# EasyEDA Pro project ProProject_Strain Gauge Paddle_2024-04-27.epro

# Schematic Strain Gauge Paddle

## Sheets
1 ESP and Power: Create Date: 2023-10-29; Page Name: ESP and Power; Project Name: Strain Gauge Paddle; Schematic Name: Strain Gauge Paddle; Update Date: 2024-03-07; Company: EasyEDA.com; Drawed: EasyEDA Pro; Page Size: A4; Part Number: JLCPCB-002; Reviewed: EasyEDA Pro; Version: V0.1
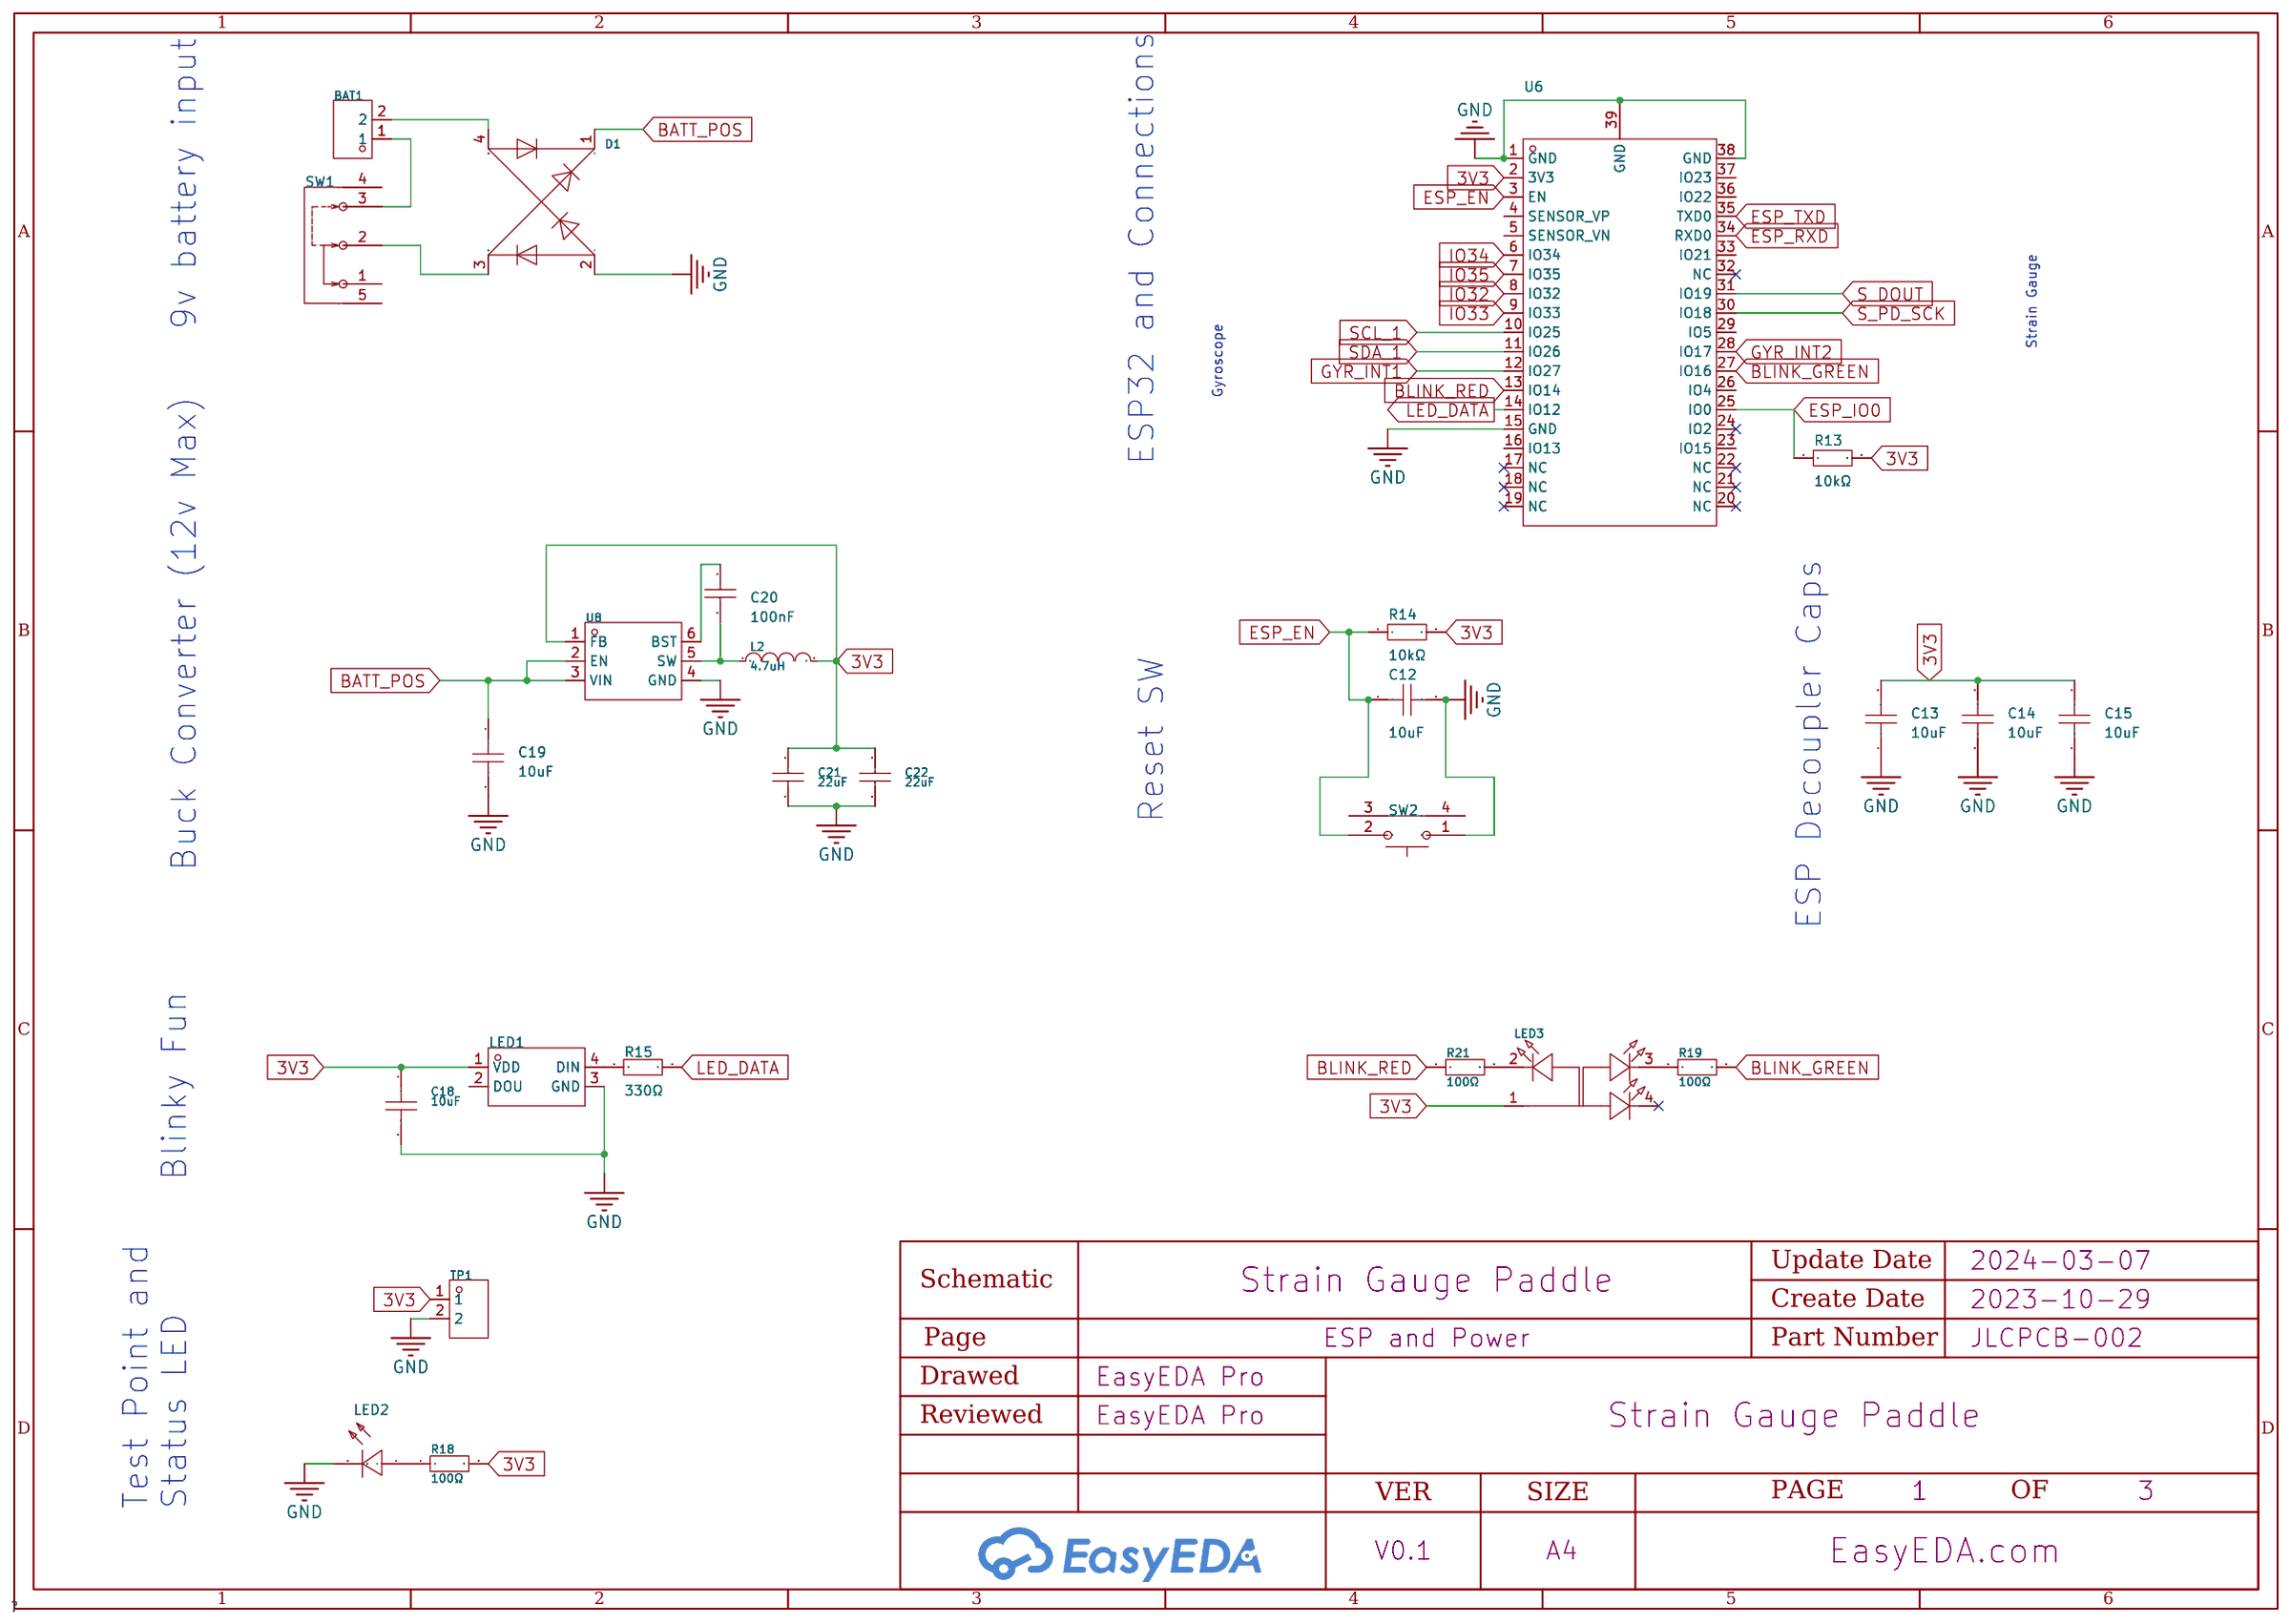
[diagram p0: ESP and Power]
2 Gyroscope and Strain Guage: Page Name: Gyroscope and Strain Guage; Update Date: 2024-03-12; Version: V0.2
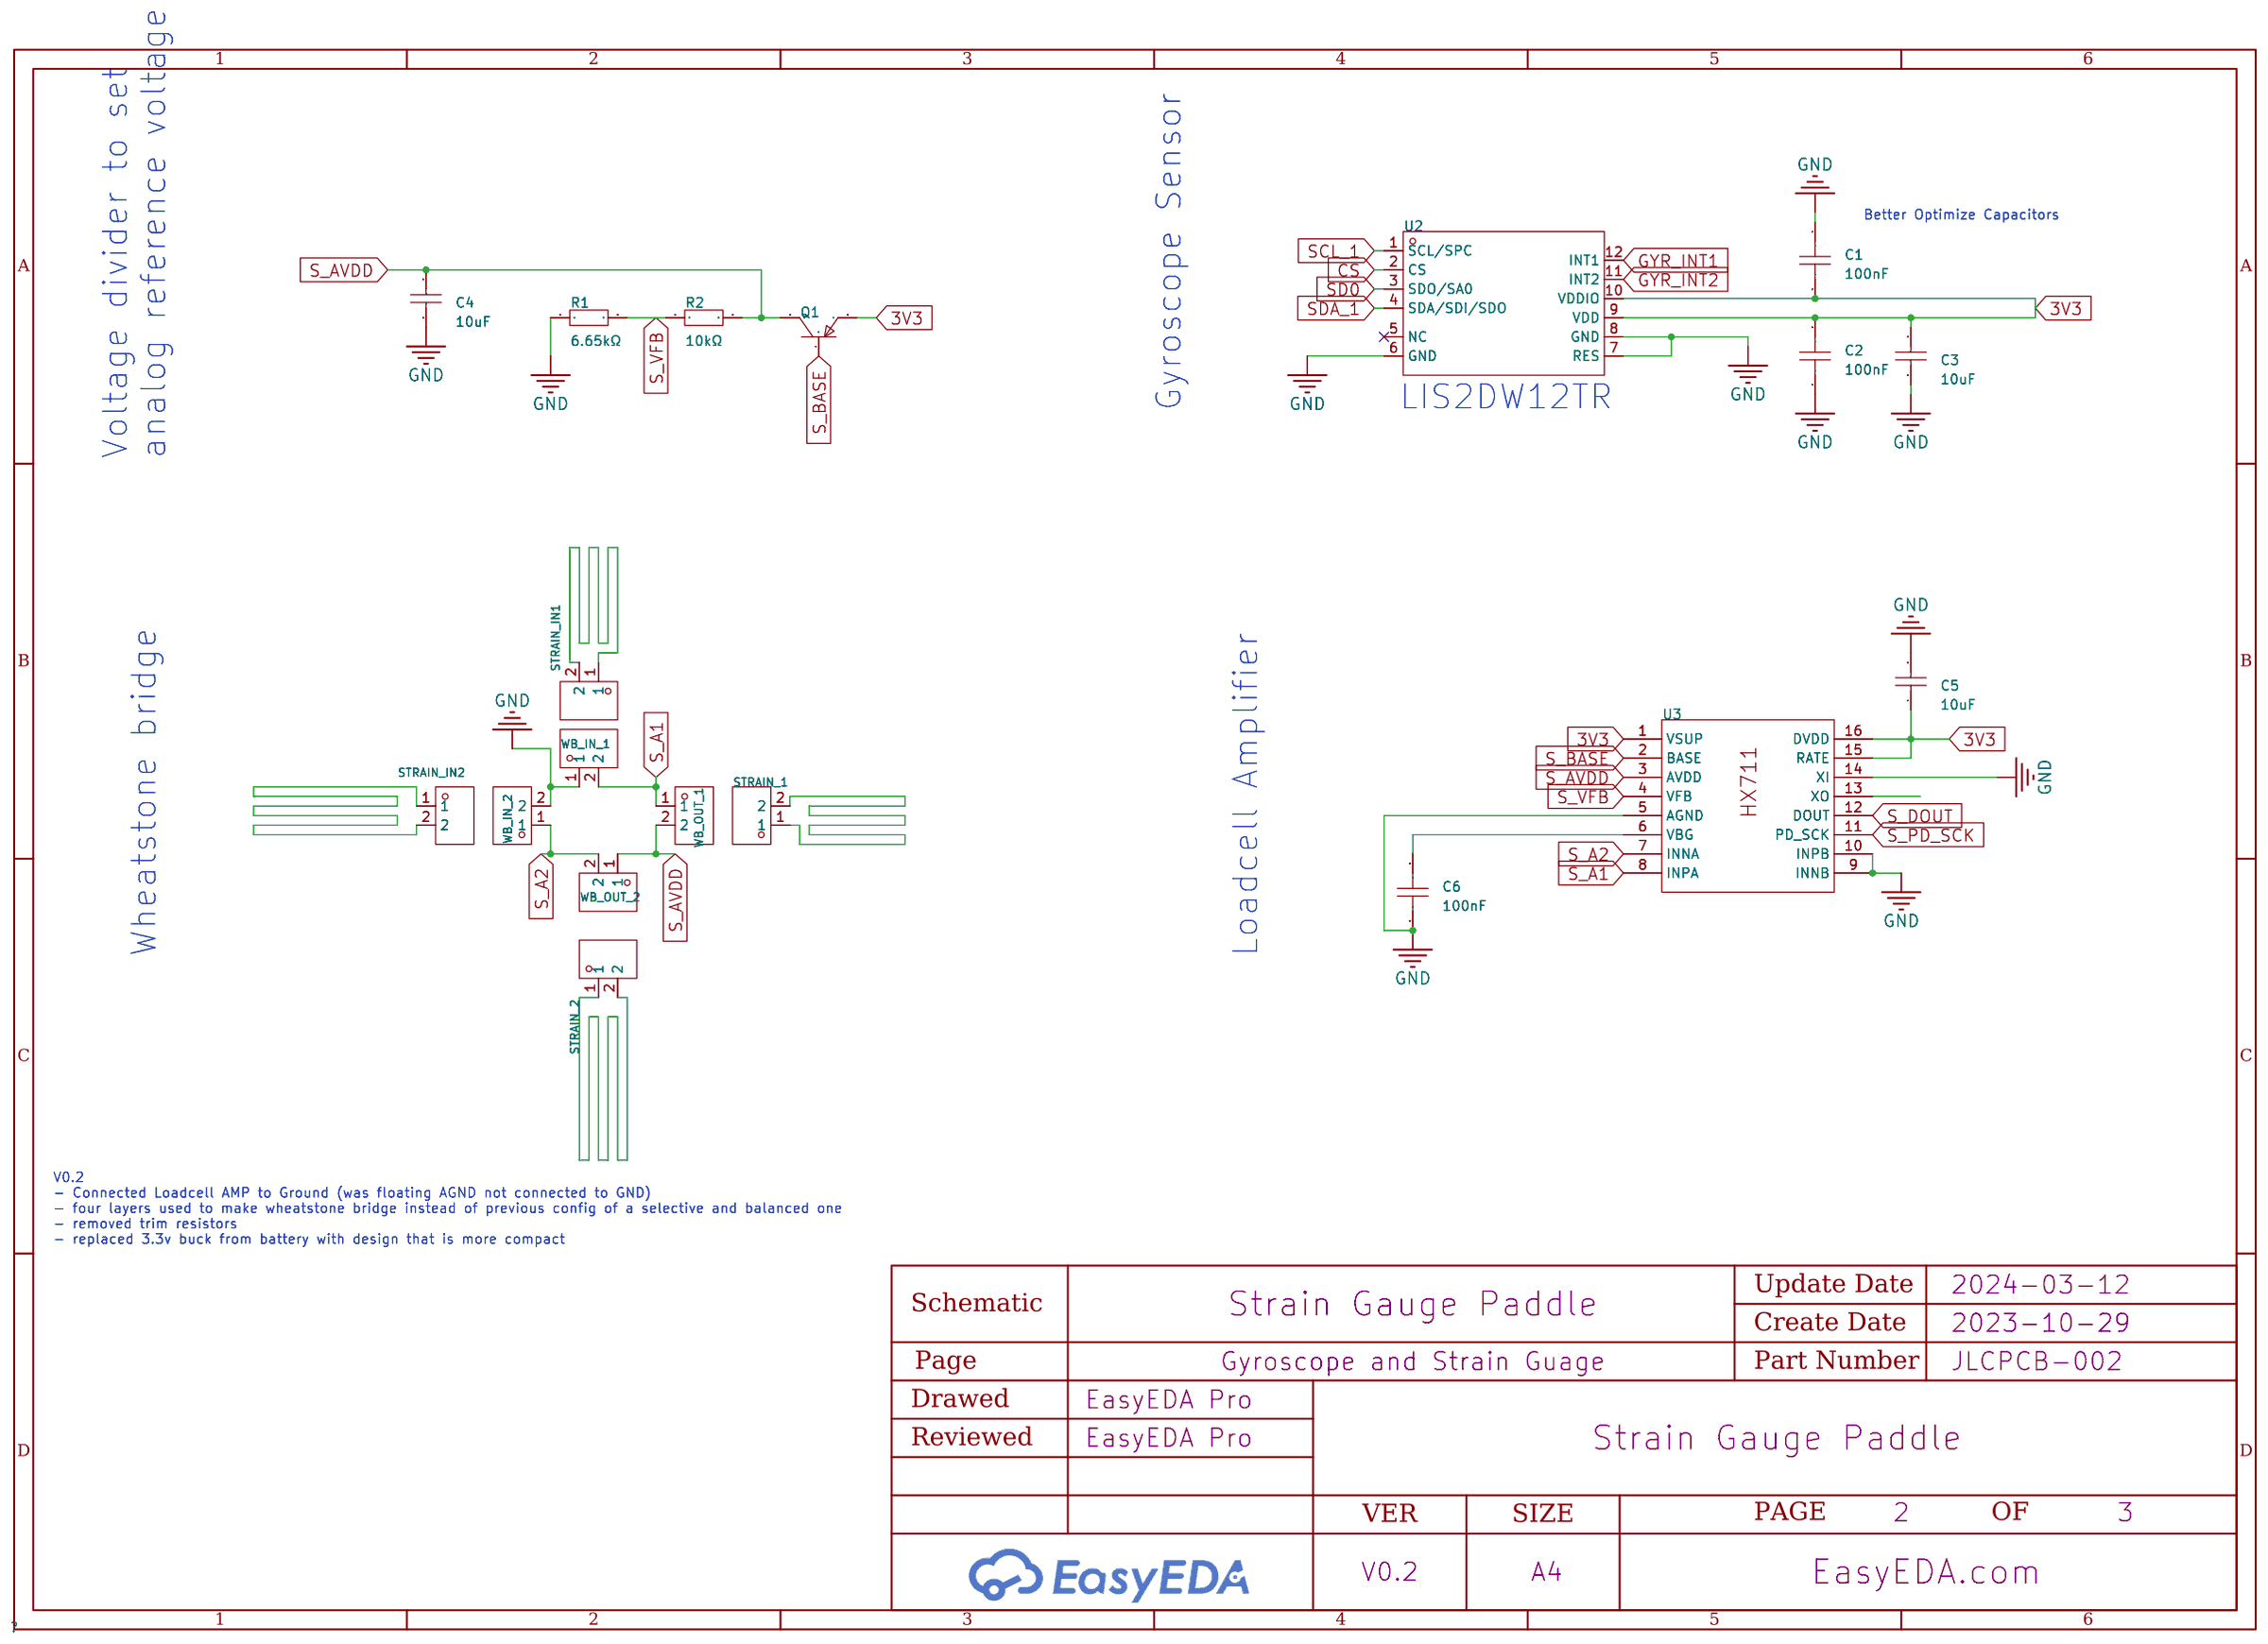
[diagram p1: Gyroscope and Strain Guage]
3 Serial: Create Date: 2023-11-12; Page Name: P3; Update Date: 2023-11-11
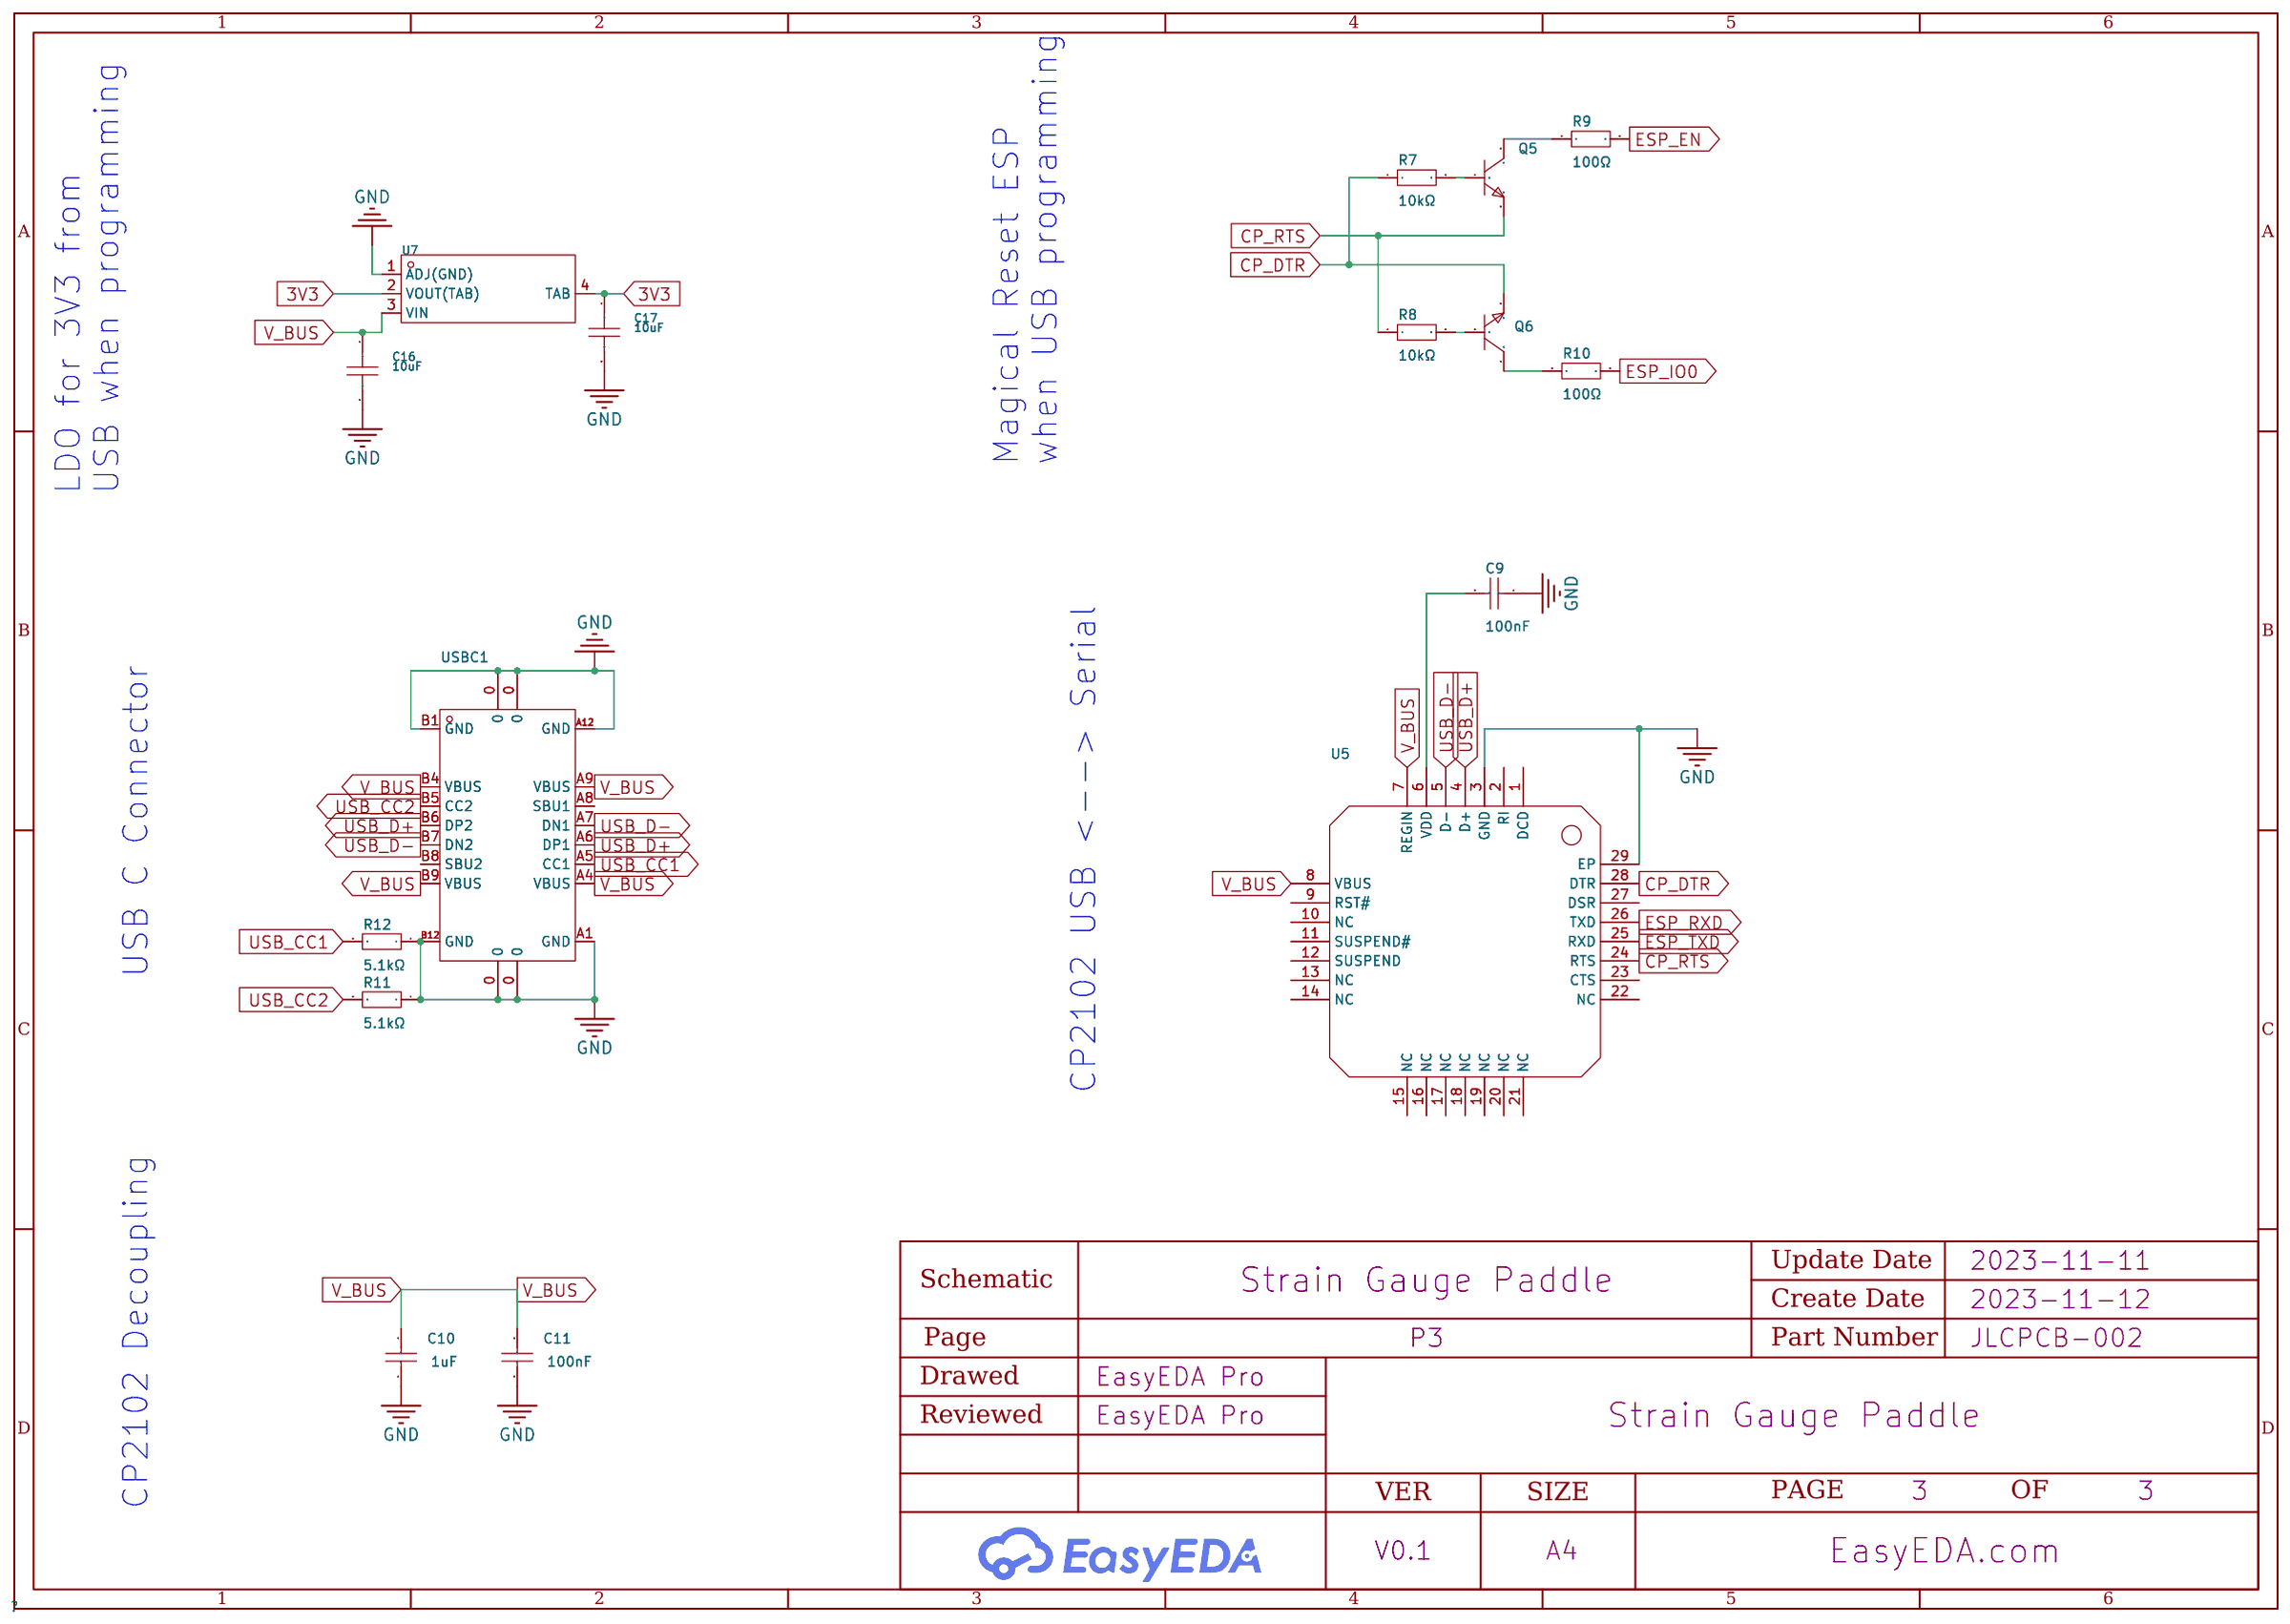
[diagram p2: Serial]

## Parts
sheet ESP and Power
BAT1  PZ254V-11-02P  [HDR-TH_2P-P2.54-V-M]  (no BOM)
C12  10uF  [C0402]
C13  10uF  [C0402]
C14  10uF  [C0402]
C15  10uF  [C0402]
C18  10uF  [C0603]
C19  10uF  [C0603]
C20  100nF  [C0603]
C21  22uF  [C1206]
C22  22uF  [C1206]
D1  MB10S  [MBS_L4.7-W3.8-P2.40-LS7.0-TL]
L2  4.7uH  [IND-SMD_L5.4-W5.2_FXL0530]
LED1  XL-5050RGBC-WS2812B  [LED-SMD_4P-L5.0-W5.0-BL_XL-5050RGBC]
LED2  BL-HJC36G-AV-TRB  [LED0603-R-RD_AMBER]
LED3  NH-B1010RGBT-HF  [LED-ARRAY-SMD_4P-L1.0-W1.0-TR_NH-B1010RGBT]
R13  10kΩ  [R0402]
R14  10kΩ  [R0402]
R15  330Ω  [R0603]
R18  100Ω  [R0603]
R19  100Ω  [R0603]
R21  100Ω  [R0603]
SW1  SK12D07VG4  [SW-TH_SK12D07VG4]
SW2  1TS003B-1400-3500A-CT  [KEY-SMD_1TS003B]
TP1  PZ254V-11-02P  [HDR-TH_2P-P2.54-V-M]  (no BOM)
U6  -  [WIFI-SMD_ESP32-WROOM-32E]
U8  AP63203WU-7  [TSOT-26_L2.9-W1.6-P0.95-LS2.8-BL]
sheet Gyroscope and Strain Guage
C1  100nF  [C0603]
C2  100nF  [C0603]
C3  10uF  [C0805]
C4  10uF  [C0805]
C5  10uF  [C0805]
C6  100nF  [C0603]
Q1  S8550  [SOT-23-3_L2.9-W1.3-P1.90-LS2.4-BR]
R1  6.65kΩ  [R0603]
R2  10kΩ  [R0805]
STRAIN_1  PZ254V-11-02P  [HDR-TH_2P-P2.54-V-M]  (no BOM)
STRAIN_2  PZ254V-11-02P  [HDR-TH_2P-P2.54-V-M]  (no BOM)
STRAIN_IN1  PZ254V-11-02P  [HDR-TH_2P-P2.54-V-M]  (no BOM)
STRAIN_IN2  PZ254V-11-02P  [HDR-TH_2P-P2.54-V-M]  (no BOM)
U2  LIS2DW12TR  [LGA-12_L2.0-W2.0-P0.50-BL]
U3  HX711  [SOP-16_L10.0-W3.9-P1.27-LS6.0-BL]
WB_IN_1  PZ254V-11-02P  [HDR-TH_2P-P2.54-V-M]  (no BOM)
WB_IN_2  PZ254V-11-02P  [HDR-TH_2P-P2.54-V-M]  (no BOM)
WB_OUT_1  PZ254V-11-02P  [HDR-TH_2P-P2.54-V-M]  (no BOM)
WB_OUT_2  PZ254V-11-02P  [HDR-TH_2P-P2.54-V-M]  (no BOM)
sheet Serial
C9  100nF  [C0402]
C10  1uF  [C0402]
C11  100nF  [C0402]
C16  10uF  [C0603]
C17  10uF  [C0603]
Q5  -  [SOT-23-3_L2.9-W1.3-P1.90-LS2.4-BR]
Q6  -  [SOT-23-3_L2.9-W1.3-P1.90-LS2.4-BR]
R7  10kΩ  [R0402]
R8  10kΩ  [R0402]
R9  100Ω  [R0402]
R10  100Ω  [R0402]
R11  5.1kΩ  [R0402]
R12  5.1kΩ  [R0402]
U5  -  [WQFN-28_L5.0-W5.0-P0.50-BL-EP3.2]
U7  AMS1117-3.3  [SOT-223-4_L6.5-W3.5-P2.30-LS7.0-BR]
USBC1  -  [USB-C_SMD-TYPE-C-31-M-12]

## Library data of the parts
BAT1 STRAIN_1 STRAIN_2 STRAIN_IN1 STRAIN_IN2 TP1 WB_IN_1 WB_IN_2 WB_OUT_1 WB_OUT_2 = PZ254V-11-02P: Number of Rows:Plugin Number of Pins:2P Pitch:2.54mm Pin Structure:1x2P Row Spacing:- Mounting Type:Straight Circluar Pins/Square Pins:Square Pins Current Rating (Max):- Voltage Rating (Max):- Length of Mating Pin:6mm Insulation Height:2.5mm Length of End; LCSC Part Name: 2.54mm 1x2P 直插 方针; Supplier Part: C492401; Manufacturer: XFCN(兴飞); Supplier Footprint: 插件,P=2.54mm; JLCPCB Part Class: Extended Part; Datasheet: https://atta.szlcsc.com/upload/public/pdf/source/20200309/C492401_A812433581A9B211A7FFA413ADDFF0E5.pdf; Supplier: LCSC; Number of Rows: Plugin; Number of Pins: 2P; Pitch: 2.54mm; Pin Structure: 1x2P; Mounting Type: Straight; Circluar Pins/Square Pins: Square Pins; Length of Mating Pin: 6mm; Insulation Height: 2.5mm; Length of End Connection Pin: 3mm; Operating Temperature Range: -40℃~+105℃; Color: Black
C12-C15 = GRM155R61A106ME44D: Capacitance:10uF Tolerance:±20% Tolerance:±20% Voltage Rated:10V Temperature Coefficient:X5R; LCSC Part Name: 10uF ±20% 10V; Supplier Part: C77000; Manufacturer: muRata(村田); Supplier Footprint: 0402; JLCPCB Part Class: Extended Part; Datasheet: https://atta.szlcsc.com/upload/public/pdf/source/20180530/C77000_4866797CFE3A842CD03C597EBD6AE6CD.pdf; Supplier: LCSC; Tolerance: ±20%; Voltage Rated: 10V; Temperature Coefficient: X5R
C16-C18 = CL10A106MQ8NNNC: Capacitance: Tolerance:±20% Tolerance:±20% Voltage Rated: Temperature Coefficient:; LCSC Part Name: 10uF ±20% 6.3V; Supplier Part: C1691; Manufacturer: SAMSUNG(三星); Supplier Footprint: 0603; JLCPCB Part Class: Extended Part; Datasheet: https://atta.szlcsc.com/upload/public/pdf/source/20160218/1457707763339.pdf; Supplier: LCSC; Tolerance: ±20%
C19 = CL10A106KP8NNNC: Capacitance: Tolerance:±10% Tolerance:±10% Voltage Rated: Temperature Coefficient:; LCSC Part Name: 10uF ±10% 10V; Supplier Part: C19702; Manufacturer: SAMSUNG(三星); Supplier Footprint: 0603; JLCPCB Part Class: Basic Part; Datasheet: https://atta.szlcsc.com/upload/public/pdf/source/20160103/1457707703378.pdf; Supplier: LCSC; Tolerance: ±10%
C20 = 0603B104K500NT_C30926: Capacitance: Tolerance:±10% Tolerance:±10% Voltage Rated: Temperature Coefficient:; LCSC Part Name: 100nF ±10% 50V; Supplier Part: C30926; Manufacturer: FH(风华); Manufacturer Part: 0603B104K500NT; Supplier Footprint: 0603; JLCPCB Part Class: Extended Part; Datasheet: https://atta.szlcsc.com/upload/public/pdf/source/20170923/C30926_1506149436298988724.pdf; Supplier: LCSC; Tolerance: ±10%
C21 C22 = CL31A226KAHNNNE: Capacitance: Tolerance:±10% Tolerance:±10% Voltage Rated: Temperature Coefficient:; LCSC Part Name: 22uF ±10% 25V; Supplier Part: C12891; Manufacturer: SAMSUNG(三星); Supplier Footprint: 1206; JLCPCB Part Class: Basic Part; Datasheet: https://atta.szlcsc.com/upload/public/pdf/source/20160218/1457707763339.pdf; Supplier: LCSC; Tolerance: ±10%
D1 = MB10S_C2488: Reverse Voltage (Vr): Average Rectified Current (Io): Forward Voltage (Vf@If):1.1V@400mA Reverse Leakage Current (Ir):5uA@1kV Peak Forward Surge Current: Operating Temperature:-55℃~+150℃@(Tj) Operating Temperature:-55℃~+150℃@(Tj); LCSC Part Name: 电压:1kV 电流:1A 大芯片  .; Supplier Part: C2488; Manufacturer: MDD; Supplier Footprint: MBS; JLCPCB Part Class: Basic Part; Datasheet: https://atta.szlcsc.com/upload/public/pdf/source/20210506/C2487_3177A890C810790094D6606D0B30B249.pdf; Supplier: LCSC; Forward Voltage (Vf@If): 1.1V@400mA; Reverse Leakage Current (Ir): 5uA@1kV; Operating Temperature: -55℃~+150℃@(Tj)
L2 = FXL0530-4R7-M: Inductance: Tolerance:±20% Tolerance:±20% Rated Current: Saturation Current (Isat):5A DC Resistance (DCR):; LCSC Part Name: 4.7uH ±20% 4.5A 50mΩ; Supplier Part: C177246; Manufacturer: cjiang(长江微电); Supplier Footprint: SMD,5.4x5.2x2.8mm; JLCPCB Part Class: Extended Part; Supplier: LCSC; Tolerance: ±20%; Saturation Current (Isat): 5A
LED1 = XL-5050RGBC-WS2812B: Emitted Color:RGB Diode Configuration:- Lens Color:Colorless transparence Dominant Wavelength:- Dominant Wavelength:- Peak Wavelength:625nm；470nm；530nm Color Temperature:- Color Temperature:- Forward Current:- Power Dissipation:- Viewing Angle:120° Mounti; LCSC Part Name: RGB三色 正贴 幻彩; Supplier Part: C2843785; Manufacturer: XINGLIGHT(成兴光); Supplier Footprint: SMD5050; JLCPCB Part Class: Extended Part; Datasheet: https://atta.szlcsc.com/upload/public/pdf/source/20230111/86AAD2096485A2E5BCAB883FF8CBE6FD.pdf; Supplier: LCSC; Emitted Color: RGB; Lens Color: Colorless transparence; Peak Wavelength: 625nm；470nm；530nm; Viewing Angle: 120°; Mounting Sytle: Positive post; Operating Temperature: -30℃~+70℃
LED2 = BL-HJC36G-AV-TRB: Emitted Color:琥珀 Diode Configuration:- Lens Color:Colorless transparence Dominant Wavelength:600nm~610nm Dominant Wavelength:600nm~610nm Peak Wavelength:610nm Color Temperature:- Color Temperature:- Forward Current:20mA Power Dissipation:50mW Viewing Angl; LCSC Part Name: 琥珀; Supplier Part: C165983; Manufacturer: BrtLed(佰鸿); Supplier Footprint: 0603; JLCPCB Part Class: Extended Part; Datasheet: https://atta.szlcsc.com/upload/public/pdf/source/20180423/C165983_15824C4AC102B53D51061E9D029254F9.pdf; Supplier: LCSC; Emitted Color: 琥珀; Lens Color: Colorless transparence; Dominant Wavelength: 600nm~610nm; Peak Wavelength: 610nm; Forward Current: 20mA; Power Dissipation: 50mW; Viewing Angle: 120°; Operating Temperature: -40℃~+85℃
LED3 = NH-B1010RGBT-HF: Emitted Color:RGB Diode Configuration:Common anode Lens Color:- Dominant Wavelength:470nm；620nm；530nm Dominant Wavelength:470nm；620nm；530nm Peak Wavelength:- Color Temperature:- Color Temperature:- Forward Current:2mA；5mA Power Dissipation:24mW；32mW Viewi; LCSC Part Name: RGB三色 1010RGB; Supplier Part: C2874113; Manufacturer: 国星光电; Supplier Footprint: 0404; JLCPCB Part Class: Extended Part; Datasheet: https://atta.szlcsc.com/upload/public/pdf/source/20210810/0B2E174735C36A18A5A2783CB3D0373F.pdf; Supplier: LCSC; Emitted Color: RGB; Diode Configuration: Common anode; Dominant Wavelength: 470nm；620nm；530nm; Forward Current: 2mA；5mA; Power Dissipation: 24mW；32mW; Viewing Angle: 120°; Operating Temperature: -30℃~+85℃
R7 R8 R13 R14 = WR04X1002FTL: Resistance:10kΩ Tolerance:±1% Tolerance:±1% Power(Watts):1/16W Temperature Coefficient:±100ppm/ Temperature Coefficient:±100ppm/ Overload Voltage (Max):50V Operating Temperature Range:-55~+155 Operating Temperature Range:-55~+155; LCSC Part Name: 10kΩ ±1% 1/16W; Supplier Part: C163810; Manufacturer: 华新科(Walsin); Supplier Footprint: 0402; JLCPCB Part Class: Extended Part; Datasheet: https://atta.szlcsc.com/upload/public/pdf/source/20180228/C163810_15198053310761377184.pdf; Supplier: LCSC; Tolerance: ±1%; Power(Watts): 1/16W; Temperature Coefficient: ±100ppm/; Overload Voltage (Max): 50V; Operating Temperature Range: -55~+155
R15 = 0603WAF3300T5E: Type:Thick Film Resistors Resistance: Tolerance:±1% Tolerance:±1% Power(Watts): Temperature Coefficient:±100ppm/℃ Temperature Coefficient:±100ppm/℃ Overload Voltage (Max): Operating Temperature Range:-55℃~+155℃ Operating Temperature Range:-55℃~+155℃; LCSC Part Name: 330Ω ±1% 100mW; Supplier Part: C23138; Manufacturer: UNI-ROYAL(厚声); Supplier Footprint: 0603; JLCPCB Part Class: Basic Part; Datasheet: https://atta.szlcsc.com/upload/public/pdf/source/20200306/C422600_1E6D84923E4A46A82E41ADD87F860B5C.pdf; Supplier: LCSC; Type: Thick Film Resistors; Tolerance: ±1%; Temperature Coefficient: ±100ppm/℃; Operating Temperature Range: -55℃~+155℃
R18 R19 R21 = 0603WAF1000T5E: Type:Thick Film Resistors Resistance: Tolerance:±1% Tolerance:±1% Power(Watts): Temperature Coefficient:±200ppm/℃ Temperature Coefficient:±200ppm/℃ Overload Voltage (Max): Operating Temperature Range:-55℃~+155℃ Operating Temperature Range:-55℃~+155℃; LCSC Part Name: 厚膜电阻 100Ω ±1% 100mW; Supplier Part: C22775; Manufacturer: UNI-ROYAL(厚声); Supplier Footprint: 0603; JLCPCB Part Class: Basic Part; Datasheet: https://atta.szlcsc.com/upload/public/pdf/source/20200306/C422600_1E6D84923E4A46A82E41ADD87F860B5C.pdf; Supplier: LCSC; Type: Thick Film Resistors; Tolerance: ±1%; Temperature Coefficient: ±200ppm/℃; Operating Temperature Range: -55℃~+155℃
SW1 = SK12D07VG4: Operating Force: Contact Material: Rated Voltage(DC): Contact Rating @ Voltage: Contact Finish:- Operating Temperature: Circuit: Electrical Life Cycles: Rated Voltage(AC):- Mounting Type: Switch Function: Switch Height: Actuator Orientation:Horizontal Con; LCSC Part Name: 3脚2二档位SK12D07VG4滑动开关1P2T卧式拨动开关; Supplier Part: C393937; Manufacturer: SHOU HAN(首韩); Supplier Footprint: 插件,P=2mm; JLCPCB Part Class: Extended Part; Supplier: LCSC; Actuator Orientation: Horizontal
SW2 = 1TS003B-1400-3500A-CT: Contact Current:50mA Voltage Rating (DC):12V Power Rating:0.6W Insulation Resistance:100MΩ Circuit:SPST Mounting Style:Surface Mount Actuator Style:Rectangle button Actuator/Cap Color:Black With Lamp:No Operating Force:140gf@±30gf Mechanical Life:50000次 O; LCSC Part Name: 4.6*1.82*3.5mm 卧贴 轻触开关; Supplier Part: C319392; Manufacturer: HYP(鸿源精密); Supplier Footprint: SMD,1.8x4.6mm; JLCPCB Part Class: Extended Part; Datasheet: https://atta.szlcsc.com/upload/public/pdf/source/20181106/C319392_EA06B27D310AC8B4E1BA9275A0C91ACF.pdf; Supplier: LCSC; Contact Current: 50mA; Voltage Rating (DC): 12V; Power Rating: 0.6W; Insulation Resistance: 100MΩ; Circuit: SPST; Mounting Style: Surface Mount; Actuator Style: Rectangle button; Actuator/Cap Color: Black; With Lamp: No; Operating Force: 140gf@±30gf; Mechanical Life: 50000次; Operating Temperature: -40℃~+90℃; Pin Style: J pin; Switch Length: 4.6mm; Switch Width: 1.82mm; Switch Height: 3.5mm; Strike Gundam: NO
U6 = ESP32-WROOM-32E(8MB): LCSC Part Name: WIFI模块 PCB板载天线模组; Supplier Part: C701342; Manufacturer: ESPRESSIF 乐鑫; Supplier Footprint: SMD38,18x25.5x3.1; JLCPCB Part Class: Extended Part; Datasheet: https://atta.szlcsc.com/upload/public/pdf/source/20200730/C701341_95E089979D39CD8D2471FDC7C7AF29A1.pdf; Supplier: LCSC
U8 = AP63203WU-7: Supplier Part: C780769; Manufacturer: DIODES(美台); Supplier Footprint: TSOT-26; JLCPCB Part Class: Extended Part; Datasheet: https://atta.szlcsc.com/upload/public/pdf/source/20210622/C780769_099C67289BD3EC61AAFB52D8B07125B3.pdf; Supplier: LCSC
C1 C2 C6 = CC0603KRX7R9BB104: Capacitance: Tolerance:±10% Tolerance:±10% Voltage Rated: Temperature Coefficient:; LCSC Part Name: 100nF ±10% 50V; Supplier Part: C14663; Manufacturer: YAGEO(国巨); Supplier Footprint: 0603; JLCPCB Part Class: Basic Part; Datasheet: https://atta.szlcsc.com/upload/public/pdf/source/20180910/C282072_33301C7F631E79921B82A8DAC6BCC5B3.pdf; Supplier: LCSC; Tolerance: ±10%
C3-C5 = CL21A106KAYNNNE_C15850: Capacitance: Tolerance:±10% Tolerance:±10% Voltage Rated: Temperature Coefficient:; LCSC Part Name: 10uF ±10% 25V; Supplier Part: C15850; Manufacturer: SAMSUNG(三星); Manufacturer Part: CL21A106KAYNNNE; Supplier Footprint: 0805; JLCPCB Part Class: Basic Part; Datasheet: https://atta.szlcsc.com/upload/public/pdf/source/20160103/1457707679302.pdf; Supplier: LCSC; Tolerance: ±10%
Q1 = S8550_C2891805: Supplier Part: C2891805; Manufacturer: YONGYUTAI(永裕泰); Supplier Footprint: SOT-23; JLCPCB Part Class: Extended Part; Datasheet: https://atta.szlcsc.com/upload/public/pdf/source/20210901/65C3C4D1695A9271DEFEFE0B623CB3B1.pdf; Supplier: LCSC
R1 = 0603WAF6651T5E: Type:Thick Film Resistors Resistance: Tolerance:±1% Tolerance:±1% Power(Watts): Temperature Coefficient:±100ppm/℃ Temperature Coefficient:±100ppm/℃ Overload Voltage (Max): Operating Temperature Range:-55℃~+155℃ Operating Temperature Range:-55℃~+155℃; LCSC Part Name: 6.65kΩ ±1% 100mW; Supplier Part: C60344; Manufacturer: UNI-ROYAL(厚声); Supplier Footprint: 0603; JLCPCB Part Class: Extended Part; Datasheet: https://atta.szlcsc.com/upload/public/pdf/source/20200306/C422600_1E6D84923E4A46A82E41ADD87F860B5C.pdf; Supplier: LCSC; Type: Thick Film Resistors; Tolerance: ±1%; Temperature Coefficient: ±100ppm/℃; Operating Temperature Range: -55℃~+155℃
R2 = 0805W8F1002T5E: Type:Thick Film Resistors Resistance: Tolerance:±1% Tolerance:±1% Power(Watts): Temperature Coefficient:±100ppm/℃ Temperature Coefficient:±100ppm/℃ Overload Voltage (Max): Operating Temperature Range:-55℃~+155℃ Operating Temperature Range:-55℃~+155℃; LCSC Part Name: 10kΩ ±1% 125mW; Supplier Part: C17414; Manufacturer: UNI-ROYAL(厚声); Supplier Footprint: 0805; JLCPCB Part Class: Basic Part; Datasheet: https://atta.szlcsc.com/upload/public/pdf/source/20200306/C422600_1E6D84923E4A46A82E41ADD87F860B5C.pdf; Supplier: LCSC; Type: Thick Film Resistors; Tolerance: ±1%; Temperature Coefficient: ±100ppm/℃; Operating Temperature Range: -55℃~+155℃
U2 = LIS2DW12TR: Supplier Part: C189624; Manufacturer: ST(意法半导体); Supplier Footprint: LGA-12; JLCPCB Part Class: Extended Part; Datasheet: https://atta.szlcsc.com/upload/public/pdf/source/20180403/C189624_150963097ED842400E055DE40577DCB1.pdf; Supplier: LCSC
U3 = HX711: Supplier Part: C43656; Manufacturer: AVIA(海芯科技); Supplier Footprint: SOP-16; JLCPCB Part Class: Extended Part; Datasheet: https://atta.szlcsc.com/upload/public/pdf/source/20201105/C43656_14FD91CAE53E7DB415D03EABCB162D83.pdf; Supplier: LCSC
C9 C11 = 0402X104K250CT: Capacitance:100nF Tolerance:±10% Tolerance:±10% Voltage Rated:25V Temperature Coefficient:X5R; LCSC Part Name: 100nF ±10% 25V; Supplier Part: C237172; Manufacturer: 华新科(Walsin); Supplier Footprint: 0402; JLCPCB Part Class: Extended Part; Datasheet: https://atta.szlcsc.com/upload/public/pdf/source/20180806/C237172_13C8C970B0EC31A3E454807C4A5F32DE.pdf; Supplier: LCSC; Tolerance: ±10%; Voltage Rated: 25V; Temperature Coefficient: X5R
C10 = GRM155R61E105KA12D: Capacitance:1uF Tolerance:±10% Tolerance:±10% Voltage Rated:25V Temperature Coefficient:X5R; LCSC Part Name: 1uF ±10% 25V; Supplier Part: C77009; Manufacturer: muRata(村田); Supplier Footprint: 0402; JLCPCB Part Class: Extended Part; Datasheet: https://atta.szlcsc.com/upload/public/pdf/source/20180326/C77009_C84F63FC30571BAC77C5C818267378FE.pdf; Supplier: LCSC; Tolerance: ±10%; Voltage Rated: 25V; Temperature Coefficient: X5R
Q5 Q6 = BC817: Transistor Type:NPN Collector-Emitter Breakdown Voltage (Vceo):45V Collector Current (Ic):500mA Power Dissipation (Pd):300mW Collector-Emitter Saturation Voltage (VCE(sat)@Ic,Ib):700mV@500mA,50mA DC Current Gain (hFE@Ic,Vce):100@100mA,1V Transition Freque; LCSC Part Name: BC817-16; Supplier Part: C2137; Manufacturer: CJ（江苏长电/长晶）; Supplier Footprint: SOT-23(SOT-23-3); JLCPCB Part Class: Extended Part; Datasheet: https://atta.szlcsc.com/upload/public/pdf/source/20140809/1457707208989.pdf; Supplier: LCSC; Transistor Type: NPN; Collector-Emitter Breakdown Voltage (Vceo): 45V; Collector Current (Ic): 500mA; Power Dissipation (Pd): 300mW; Collector-Emitter Saturation Voltage (VCE(sat)@Ic,Ib): 700mV@500mA,50mA; DC Current Gain (hFE@Ic,Vce): 100@100mA,1V; Transition Frequency (fT): 100MHz; Operating Temperature: +150@(Tj)
R9 R10 = AECR0402F100RK9: Type:厚膜电阻 Resistance:100Ω Tolerance:±1% Power(Watts):63mW Temperature Coefficient:±100ppm/ Temperature Coefficient:±100ppm/ Overload Voltage (Max):50V Operating Temperature Range:-55~+125 Operating Temperature Range:-55~+125; LCSC Part Name: 100Ω ±1%; Supplier Part: C328297; Manufacturer: RESI(开步睿思）; Supplier Footprint: 0402; JLCPCB Part Class: Extended Part; Datasheet: https://atta.szlcsc.com/upload/public/pdf/source/20181108/C328297_22D2FD9B6826111D81BA2099DA41EA29.pdf; Supplier: LCSC; Type: 厚膜电阻; Tolerance: ±1%; Power(Watts): 63mW; Temperature Coefficient: ±100ppm/; Overload Voltage (Max): 50V; Operating Temperature Range: -55~+125
R11 R12 = ERJ2RKF5101X: Resistance:5.1kΩ Tolerance:±1% Power(Watts):1/10W Temperature Coefficient:±100ppm/ Temperature Coefficient:±100ppm/ Overload Voltage (Max):- Operating Temperature Range:-55~+155 Operating Temperature Range:-55~+155; LCSC Part Name: 5.1kΩ ±1%; Supplier Part: C278598; Manufacturer: PANASONIC(松下); Supplier Footprint: 0402; JLCPCB Part Class: Extended Part; Datasheet: https://atta.szlcsc.com/upload/public/pdf/source/20181114/C278598_63FD5E98FC43ADF35472DB19D0990B3C.pdf; Supplier: LCSC; Tolerance: ±1%; Power(Watts): 1/10W; Temperature Coefficient: ±100ppm/; Operating Temperature Range: -55~+155
U5 = CP2102-GMR: Type:Transceiver Protocol:USB Number of Drivers/Receivers:1/1 Data Rate:1Mbps Supply Voltage:3V ~ 3.6V; Supplier Part: C6568; Manufacturer: SILICON LABS(芯科); Supplier Footprint: QFN-28_5x5x05P; JLCPCB Part Class: Basic Part; Datasheet: https://atta.szlcsc.com/upload/public/pdf/source/20170103/1483439882795.pdf; Supplier: LCSC; Type: Transceiver; Protocol: USB; Number of Drivers/Receivers: 1/1; Data Rate: 1Mbps; Supply Voltage: 3V ~ 3.6V
U7 = AMS1117-3.3_C347222: Output Type: Output Polarity:Positive Number of Outputs:1 Maximum Input Voltage:18V Output Voltage:3.3V Output Voltage:3.3V Dropout Voltage:1.3V@(1A) Output Current:1A Power Supply Rejection Ratio (PSRR):60dB@(120Hz); LCSC Part Name: 输入18V 输出3.3V 1A; Supplier Part: C347222; Manufacturer: UMW(友台半导体); Supplier Footprint: SOT-223; JLCPCB Part Class: Extended Part; Datasheet: https://atta.szlcsc.com/upload/public/pdf/source/20211011/50CC665C22E3A66C08379A4A74BDA25C.pdf; Supplier: LCSC; Output Polarity: Positive; Number of Outputs: 1; Maximum Input Voltage: 18V; Output Voltage: 3.3V; Dropout Voltage: 1.3V@(1A); Output Current: 1A; Power Supply Rejection Ratio (PSRR): 60dB@(120Hz)
USBC1 = TYPE-C-31-M-12: Connector Type:Type-C Standard:- Gender:母座 Number of Contacts:16 Number of Ports:1 Current Rating - Power (Max):250mA; Supplier Part: C165948; Manufacturer: 韩国韩荣; JLCPCB Part Class: Extended Part; Datasheet: https://atta.szlcsc.com/upload/public/pdf/source/20210111/C2682493_D8CCFED08835E878D16ACCF4460E43B8.pdf; Supplier: LCSC; Connector Type: Type-C; Gender: 母座; Number of Contacts: 16; Number of Ports: 1; Current Rating - Power (Max): 250mA

## Nets
3V3: C1.2 C2.2 C3.2 C5.1 C13.2 C14.2 C15.2 C17.1 C18.1 C21.1 C22.1 L2.2 LED1.1(VDD) LED3.1(+) Q1.2(E) R13.2 R14.2 R18.2 TP1.1 U2.9(VDD) U2.10(VDDIO) U3.1(VSUP) U3.15(RATE) U3.16(DVDD) U6.2(3V3) U7.2(VOUT(TAB)) U7.4(TAB) U8.1(FB)
GND: C1.1 C2.1 C3.1 C4.1 C5.2 C6.1 C9.1 C10.1 C11.1 C12.2 C13.1 C14.1 C15.1 C16.2 C17.2 C18.2 C19.2 C21.2 C22.2 D1.2(-) LED1.3(GND) LED2.2(C) R1.1 R11.1 R12.1 SW2.1 TP1.2 U2.6(GND) U2.7(RES) U2.8(GND) U3.5(AGND) U3.9(INNB) U3.10(INPB) U3.14(XI) U5.3(GND) U5.29(EP) U6.1(GND) U6.15(GND) U6.38(GND) U6.39(GND) U7.1(ADJ(GND)) U8.4(GND) USBC1.0 USBC1.A1(GND) USBC1.A12(GND) USBC1.B1(GND) USBC1.B12(GND) WB_IN_1.1 WB_IN_2.2
BATT_POS: C19.1 D1.1(+) U8.2(EN) U8.3(VIN)
BLINK_GREEN: R19.2 U6.27(IO16)
BLINK_RED: R21.1 U6.13(IO14)
CP_DTR: Q6.2(E) R7.1 U5.28(DTR)
CP_RTS: Q5.2(E) R8.1 U5.24(RTS)
CS: U2.2(CS)
ESP_EN: C12.1 R9.2 R14.1 SW2.2 U6.3(EN)
ESP_IO0: R10.2 R13.1 U6.25(IO0)
ESP_RXD: U5.26(TXD) U6.34(RXD0)
ESP_TXD: U5.25(RXD) U6.35(TXD0)
GYR_INT1: U2.12(INT1) U6.12(IO27)
GYR_INT2: U2.11(INT2) U6.28(IO17)
IO32: U6.8(IO32)
IO33: U6.9(IO33)
IO34: U6.6(IO34)
IO35: U6.7(IO35)
LED_DATA: R15.2 U6.14(IO12)
S_A1: U3.8(INPA) WB_IN_1.2 WB_OUT_1.1
S_A2: U3.7(INNA) WB_IN_2.1 WB_OUT_2.2
S_AVDD: C4.2 Q1.3(C) R2.2 U3.3(AVDD) WB_OUT_1.2 WB_OUT_2.1
S_BASE: Q1.1(B) U3.2(BASE)
S_DOUT: U3.12(DOUT) U6.31(IO19)
S_PD_SCK: U3.11(PD_SCK) U6.30(IO18)
S_VFB: R1.2 R2.1 U3.4(VFB)
SCL_1: U2.1(SCL/SPC) U6.10(IO25)
SD0: U2.3(SDO/SA0)
SDA_1: U2.4(SDA/SDI/SDO) U6.11(IO26)
USB_CC1: R12.2 USBC1.A5(CC1)
USB_CC2: R11.2 USBC1.B5(CC2)
USB_D+: U5.4(D+) USBC1.A6(DP1) USBC1.B6(DP2)
USB_D-: U5.5(D-) USBC1.A7(DN1) USBC1.B7(DN2)
V_BUS: C10.2 C11.2 C16.1 U5.7(REGIN) U5.8(VBUS) U7.3(VIN) USBC1.A4(VBUS) USBC1.A9(VBUS) USBC1.B4(VBUS) USBC1.B9(VBUS)
$1N3382: LED1.4(DIN) R15.1
$1N3717: LED2.1(A) R18.1
$1N4432: LED3.3(-) R19.1
$1N4504: LED3.2(-) R21.2
$1N6597: C20.1 U8.6(BST)
$1N6598: C20.2 L2.1 U8.5(SW)
$1N7407: D1.3(C2) SW1.2
$2N1710: C6.2 U3.6(VBG)
$3N1098: Q5.3(C) R9.1
$3N1099: Q6.3(C) R10.1
$3N1100: Q6.1(B) R8.2
$3N1101: Q5.1(B) R7.2
$3N1118: C9.2 U5.6(VDD)
Net-(BAT1-1): BAT1.1 SW1.3
Net-(BAT1-2): BAT1.2 D1.4(C1)
Net-(STRAIN_1-1): STRAIN_1.1 STRAIN_1.2
Net-(STRAIN_2-1): STRAIN_2.1 STRAIN_2.2
Net-(STRAIN_IN1-1): STRAIN_IN1.1 STRAIN_IN1.2
Net-(STRAIN_IN2-1): STRAIN_IN2.1 STRAIN_IN2.2

Not connected (* = marked no-connect by the designer): LED1 2(DOU); LED3 4(-)*; SW1 1 4 5; SW2 3 4; U2 5(NC)*; U3 13(XO); U5 1(DCD) 2(RI) 9(RST#) 10(NC) 11(SUSPEND#) 12(SUSPEND) 13(NC) 14(NC) 15(NC) 16(NC) 17(NC) 18(NC) 19(NC) 20(NC) 21(NC) 22(NC) 23(CTS) 27(DSR); U6 4(SENSOR_VP) 5(SENSOR_VN) 16(IO13) 17(NC)* 18(NC)* 19(NC)* 20(NC)* 21(NC)* 22(NC)* 23(IO15) 24(IO2)* 26(IO4) 29(IO5) 32(NC)* 33(IO21) 36(IO22) 37(IO23); USBC1 A8(SBU1) B8(SBU2)

## Notes on the sheets
sheet 1
- Strain Gauge
- 9v battery input
- Gyroscope
- ESP32 and Connections
- Reset SW
- Buck Converter (12v Max)
- ESP Decoupler Caps
- Blinky Fun
- Test Point and
  Status LED
sheet 2
- Better Optimize Capacitors
- LIS2DW12TR
- Gyroscope Sensor
- Voltage divider to set
  analog reference voltage
- Wheatstone bridge
- Loadcell Amplifier
- V0.2
  - Connected Loadcell AMP to Ground (was floating AGND not connected to GND)
  - four layers used to make wheatstone bridge instead of previous config of a selective and balanced one
  - removed trim resistors
  - replaced 3.3v buck from battery with design that is more compact
sheet 3
- Magical Reset ESP
  when USB programming
- LDO for 3V3 from
  USB when programming
- USB C Connector
- CP2102 USB <--> Serial
- CP2102 Decoupling

# Board PCB1
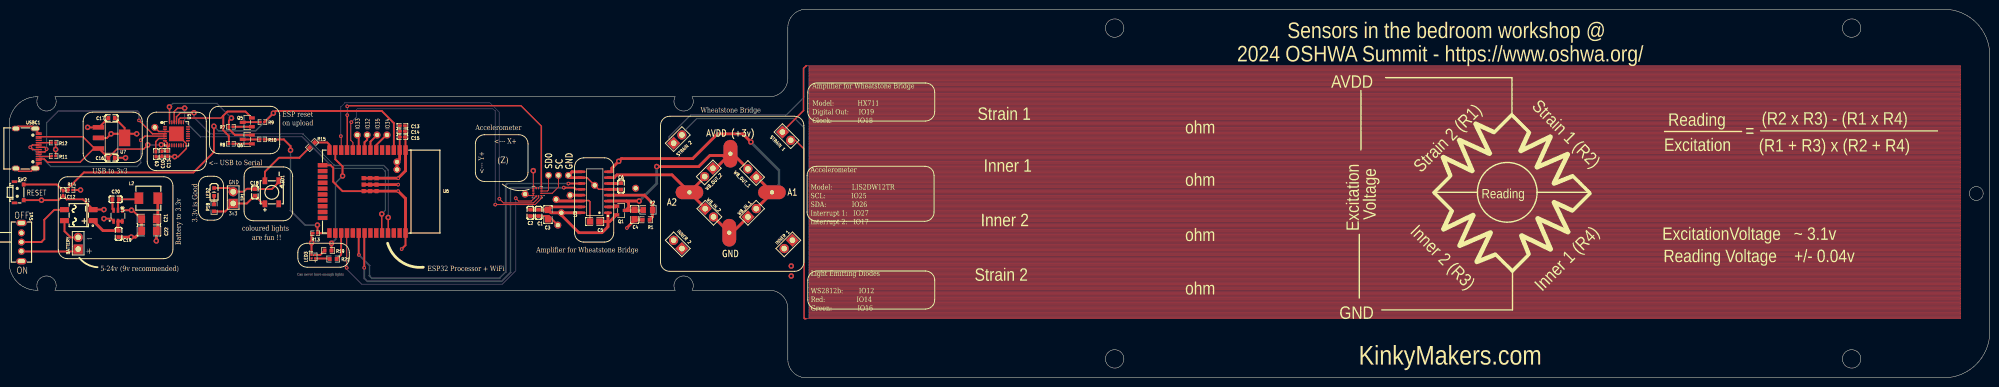
[diagram p3: board, top side]
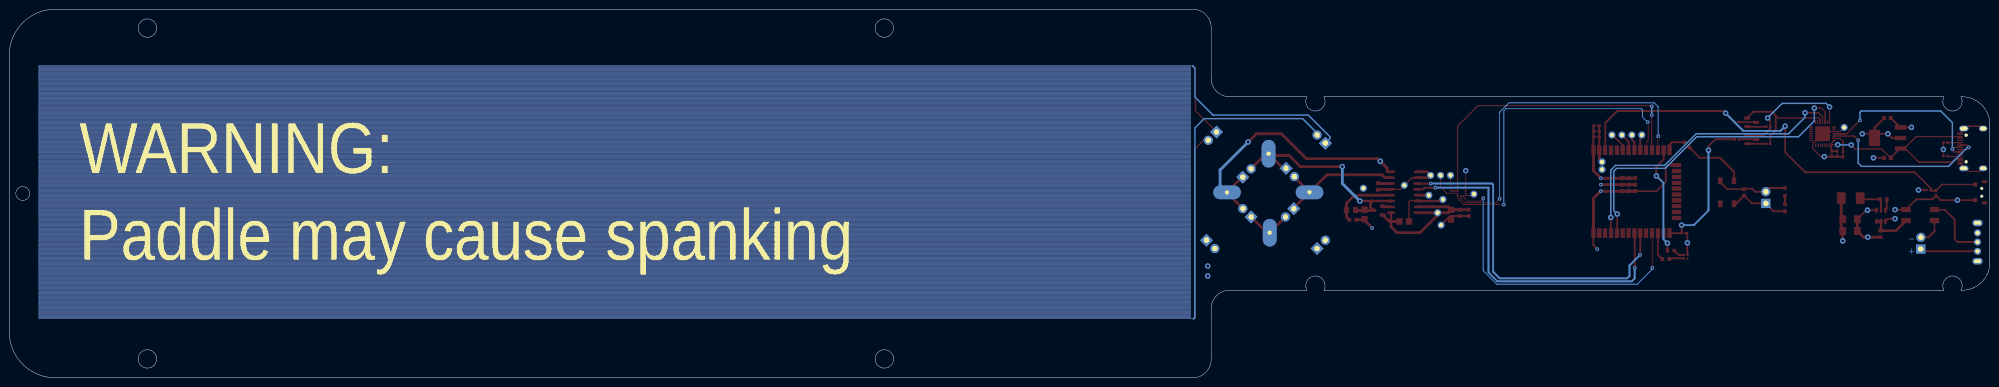
[diagram p4: board, bottom side, seen from below]

Outline 430 x 80 mm; copper layers: Top Layer, GND, 3V3, Bottom Layer. Coordinates in mm from the lower left corner of the outline.
Outline path: circle c240,75.9 r2 ; circle c240,4.1 r2 ; circle c400,75.9 r2 ; circle c400,4.1 r2 ; circle c427.07,40 r1.5 ; 0,55 arc(1.76,59.24) 6,61 6.25,61 arc(8.1,57.9) 9.95,61 144.57,61 arc(146.42,57.9) 148.26,61 165.04,61 arc(167.87,62.17) 169.04,65 169.04,76 arc(170.21,78.83) 173.04,80 420,80 arc(427.07,77.07) 430,70 430,10 arc(427.07,2.93) 420,0 173.04,0 arc(170.21,1.17) 169.04,4 169.04,15 arc(167.87,17.83) 165.04,19 148.26,19 arc(146.42,22.1) 144.57,19 9.95,19 arc(8.1,22.1) 6.25,19 6,19 arc(1.76,20.76) 0,25 0,55
Stack: Top Layer 0.035mm / Dielectric1 0.48mm PP er 4.5 / GND 0.035mm / Dielectric2 0.48mm FR4 er 4.5 / 3V3 0.035mm / Dielectric3 0.48mm PP er 4.5 / Bottom Layer 0.035mm

## Design rules (mm)
template: JLCPCB Capability(Two Layers Board)
spacing copperThickness1oz (default): track to track 0.102, other pairs 0.152 to 0.3
spacing copperThickness2oz: track to track 0.203, other pairs 0.152 to 0.3
track width copperThickness1oz (default): min 0.127, default 0.254, max 2.54
track width copperThickness2oz: min 0.203, default 0.254, max 2.54
differential pair differentialPair (default): width min 0.127, default 0.254, max 2.54; gap min 0.152, default 0.152
via viaSize (default): diameter min 0.5, default 0.61, max 10; hole min 0.3, default 0.305, max 6.3

## Placement (name value [footprint] x y rotation side)
BATTERY  PZ254V-11-02P  [HDR-TH_2P-P2.54-V-M]  14.97 29.2 90 top
C1  100nF  [C0603]  114.94 35.81 90 top
C2  100nF  [C0603]  113.14 35.81 90 top
C3  10uF  [C0805]  116.97 35.43 90 top
C4  10uF  [C0805]  135.76 35.44 90 top
C5  10uF  [C0805]  127.12 33.92 180 top
C6  100nF  [C0603]  132.84 41.54 90 top
C9  100nF  [C0402]  31.83 48.55 90 top
C10  1uF  [C0402]  33.14 48.64 90 top
C11  100nF  [C0402]  34.37 48.64 90 top
C12  10uF  [C0402]  11.67 40.09 270 top
C13  10uF  [C0402]  85.37 54.73 180 top
C14  10uF  [C0402]  85.37 53.5 180 top
C15  10uF  [C0402]  85.37 52.23 180 top
C16  10uF  [C0603]  22.21 47.75 0 top
C17  10uF  [C0603]  22.21 56.38 180 top
C18  10uF  [C0603]  53.33 40.25 90 top
C19  10uF  [C0603]  23.74 31.24 270 top
C20  100nF  [C0603]  23.1 38.73 0 top
C21  22uF  [C1206]  30.34 34.41 180 top
C22  22uF  [C1206]  30.34 31.87 180 top
D1  MB10S  [MBS_L4.7-W3.8-P2.40-LS7.0-TL]  15.1 35.3 180 top
INNER 1  PZ254V-11-02P  [HDR-TH_2P-P2.54-V-M]  169.15 28.95 225 top
INNER 2  PZ254V-11-02P  [HDR-TH_2P-P2.54-V-M]  145.15 28.95 135 top
L2  4.7uH  [IND-SMD_L5.4-W5.2_FXL0530]  30.21 38.98 0 top
LED1  XL-5050RGBC-WS2812B  [LED-SMD_4P-L5.0-W5.0-BL_XL-5050RGBC]  57.01 40.25 0 top
LED2  BL-HJC36G-AV-TRB  [LED0603-R-RD_AMBER]  44.47 40.34 270 top
LED3  NH-B1010RGBT-HF  [LED-ARRAY-SMD_4P-L1.0-W1.0-TR_NH-B1010RGBT]  66.03 26.28 90 top
NOREF  -  [Pad_e145]  121.78 39.62 0 top
NOREF#2  -  [Pad_e722]  156.33 31.49 0 top
NOREF#3  -  [Pad_e1690]  84.19 46.86 0 top
NOREF#4  -  [Pad_e92]  121.4 43.94 0 top
NOREF#5  -  [Pad_e734]  156.58 48.64 0 top
NOREF#6  -  [Pad_e186]  117.08 43.94 0 top
NOREF#7  -  [Pad_e187]  119.24 43.94 0 top
NOREF#8  -  [Pad_e109]  136.01 41.14 0 top
NOREF#9  -  [Pad_e175]  112 39.87 0 top
NOREF#10  -  [Pad_e94]  127.12 41.78 0 top
NOREF#11  -  [Pad_e501]  75.55 52.7 0 top
NOREF#12  -  [Pad_e1691]  84.19 45.21 0 top
NOREF#13  -  [Pad_e481]  77.71 52.7 0 top
NOREF#14  -  [Pad_e645]  31.61 54.35 0 top
NOREF#15  -  [Pad_e146]  118.73 38.73 0 top
NOREF#16  -  [Pad_e477]  79.87 52.7 0 top
NOREF#17  -  [Pad_e171]  119.11 33.14 0 top
NOREF#18  -  [Pad_e736]  147.69 40.25 90 top
NOREF#19  -  [Pad_e735]  165.6 40.25 90 top
NOREF#20  -  [Pad_e476]  82.03 52.7 0 top
NOREF#21  -  [Pad_e170]  119.88 35.81 0 top
Q1  S8550  [SOT-23-3_L2.9-W1.3-P1.90-LS2.4-BR]  132.83 36.32 180 top
Q5  -  [SOT-23-3_L2.9-W1.3-P1.90-LS2.4-BR]  51.7 55.44 0 top
Q6  -  [SOT-23-3_L2.9-W1.3-P1.90-LS2.4-BR]  51.7 51.74 0 top
R1  6.65kΩ  [R0603]  138.3 34.3 0 top
R2  10kΩ  [R0805]  138.67 36.44 180 top
R7  10kΩ  [R0402]  48.12 54.48 0 top
R8  10kΩ  [R0402]  48.12 50.79 0 top
R9  100Ω  [R0402]  54.98 55.49 0 top
R10  100Ω  [R0402]  54.91 51.74 0 top
R11  5.1kΩ  [R0402]  9.64 48.13 180 top
R12  5.1kΩ  [R0402]  9.64 51.05 180 top
R13  10kΩ  [R0402]  66.43 31.39 180 top
R14  10kΩ  [R0402]  13.32 40.76 0 top
R15  330Ω  [R0603]  65.77 50.54 45 top
R18  100Ω  [R0603]  44.47 36.87 270 top
R19  100Ω  [R0603]  70.35 25.78 0 top
R21  100Ω  [R0603]  69.23 27.6 180 top
STRAIN 1  PZ254V-11-02P  [HDR-TH_2P-P2.54-V-M]  168.77 52.45 315 top
STRAIN 2  PZ254V-11-02P  [HDR-TH_2P-P2.54-V-M]  145.15 51.81 45 top
SW1  SK12D07VG4  [SW-TH_SK12D07VG4]  2.66 29.46 270 top
SW2  1TS003B-1400-3500A-CT  [KEY-SMD_1TS003B]  2.15 40.25 270 top
TP1  PZ254V-11-02P  [HDR-TH_2P-P2.54-V-M]  48.63 39.11 90 top
U2  LIS2DW12TR  [LGA-12_L2.0-W2.0-P0.50-BL]  114.66 40.29 90 top
U3  HX711  [SOP-16_L10.0-W3.9-P1.27-LS6.0-BL]  127.12 40.27 90 top
U5  -  [WQFN-28_L5.0-W5.0-P0.50-BL-EP3.2]  36.31 52.95 270 top
U6  -  [WIFI-SMD_ESP32-WROOM-32E]  77.04 40.42 180 top
U7  AMS1117-3.3  [SOT-223-4_L6.5-W3.5-P2.30-LS7.0-BR]  22.21 52.06 180 top
U8  AP63203WU-7  [TSOT-26_L2.9-W1.6-P0.95-LS2.8-BL]  23.61 35.17 0 top
USBC1  -  [USB-C_SMD-TYPE-C-31-M-12]  3.93 49.78 270 top
WB_IN_1  PZ254V-11-02P  [HDR-TH_2P-P2.54-V-M]  161.28 35.81 45 top
WB_IN_2  PZ254V-11-02P  [HDR-TH_2P-P2.54-V-M]  152.01 35.81 315 top
WB_OUT_1  PZ254V-11-02P  [HDR-TH_2P-P2.54-V-M]  161.28 44.44 135 top
WB_OUT_2  PZ254V-11-02P  [HDR-TH_2P-P2.54-V-M]  151.88 44.57 225 top

## Footprints (pads in the part's own frame, mm; a bottom-side part is the same pattern mirrored in y, then rotated)
C0402
  rect 0.79x0.54 smd: 1(-0.545,0) 2(0.545,0)
C0603
  rect 0.8x0.9 smd: 1(-0.7,0) 2(0.7,0)
C0805
  rect 1.41x1.35 smd: 1(-1.03,0) 2(1.03,0)
C1206
  rect 1.485x1.728 smd: 1(-1.593,0) 2(1.593,0)
HDR-TH_2P-P2.54-V-M
  rect 2x2 hole 1.2: 1(-1.27,0)
  round 2 hole 1.2: 2(1.27,0)
IND-SMD_L5.4-W5.2_FXL0530
  rect 1.9x2.5 smd: 1(-2.05,0) 2(2.05,0)
KEY-SMD_1TS003B
  rect 0.9x0.8 smd: 1(1.7,1) 2(-1.7,1)
  rect 0.6x1.2 smd: 3(-2.3,-1) 4(2.3,-1)
LED0603-R-RD_AMBER
  rect 0.8x0.8 smd: 1(0.851,0) 2(-0.851,0)
LED-ARRAY-SMD_4P-L1.0-W1.0-TR_NH-B1010RGBT
  rect 0.45x0.45 smd: 1(0.385,0.385) 2(0.385,-0.385) 3(-0.385,-0.385) 4(-0.385,0.385)
LED-SMD_4P-L5.0-W5.0-BL_XL-5050RGBC
  rect 1x1.5 smd: 1(-1.5,-2.5) 2(1.5,-2.5) 3(1.5,2.5) 4(-1.5,2.5)
LGA-12_L2.0-W2.0-P0.50-BL
  rect 0.28x0.5 smd: 1(-0.75,-0.875) 2(-0.25,-0.875) 3(0.25,-0.875) 4(0.75,-0.875) 7(0.75,0.875) 8(0.25,0.875) 9(-0.25,0.875) 10(-0.75,0.875)
  rect 0.5x0.28 smd: 5(0.875,-0.25) 6(0.875,0.25) 11(-0.875,0.25) 12(-0.875,-0.25)
MBS_L4.7-W3.8-P2.40-LS7.0-TL
  rect 2x1.1 smd: 1(-3.1,1.2) 2(-3.1,-1.2) 3(3.1,-1.2) 4(3.1,1.2)
Pad_e92
  round 1.524 hole 0.914: 41(0,0)
Pad_e94
  round 1.524 hole 0.914: 42(0,0)
Pad_e109
  round 1.524 hole 0.914: 43(0,0)
Pad_e145
  round 1.524 hole 0.914: 44(0,0)
Pad_e146
  round 1.524 hole 0.914: 45(0,0)
Pad_e170
  round 1.524 hole 0.914: 46(0,0)
Pad_e171
  round 1.524 hole 0.914: 45(0,0)
Pad_e175
  round 1.524 hole 0.914: 46(0,0)
Pad_e186
  round 1.524 hole 0.914: 47(0,0)
Pad_e187
  round 1.524 hole 0.914: 48(0,0)
Pad_e476
  round 1.524 hole 0.914: 51(0,0)
Pad_e477
  round 1.524 hole 0.914: 52(0,0)
Pad_e481
  round 1.524 hole 0.914: 53(0,0)
Pad_e501
  round 1.524 hole 0.914: 54(0,0)
Pad_e645
  round 1.524 hole 0.914: 55(0,0)
Pad_e722
  oval 3x6 hole 0.914: 40(0,0)
Pad_e734
  oval 3x6 hole 0.914: 40(0,0)
Pad_e735
  oval 3x6 hole 0.914: 40(0,0)
Pad_e736
  oval 3x6 hole 0.914: 40(0,0)
Pad_e1690
  round 1.524 hole 0.914: 49(0,0)
Pad_e1691
  round 1.524 hole 0.914: 50(0,0)
R0402
  rect 0.566x0.54 smd: 1(-0.433,0) 2(0.433,0)
R0603
  rect 0.806x0.864 smd: 1(-0.753,0) 2(0.753,0)
R0805
  rect 1.133x1.377 smd: 1(-1,0) 2(1,0)
SOP-16_L10.0-W3.9-P1.27-LS6.0-BL
  oval 0.56x1.745 smd: 1(-4.445,-2.873) 2(-3.175,-2.873) 3(-1.905,-2.873) 4(-0.635,-2.873) 5(0.635,-2.873) 6(1.905,-2.873) 7(3.175,-2.873) 8(4.445,-2.873) 9(4.445,2.873) 10(3.175,2.873) 11(1.905,2.873) 12(0.635,2.873) 13(-0.635,2.873) 14(-1.905,2.873) 15(-3.175,2.873) 16(-4.445,2.873)
SOT-23-3_L2.9-W1.3-P1.90-LS2.4-BR
  rect 1.25x0.7 smd: 1(1,-0.95) 2(1,0.95) 3(-1,0)
SOT-223-4_L6.5-W3.5-P2.30-LS7.0-BR
  rect 2.47x0.98 smd: 1(2.835,-2.3) 2(2.835,0) 3(2.835,2.3)
  rect 2.47x3.6 smd: 4(-2.835,0)
SW-TH_SK12D07VG4
  round 1.524 hole 0.914: 1(-2,0) 2(0,0) 3(2,0)
  oval 1.4x2.2 hole 0.8x1.6: 4(4.15,0) 5(-4.15,0)
TSOT-26_L2.9-W1.6-P0.95-LS2.8-BL
  rect 0.55x1.1 smd: 1(-0.95,-1.2) 2(0,-1.2) 3(0.95,-1.2) 4(0.95,1.2) 5(0,1.2) 6(-0.95,1.2)
USB-C_SMD-TYPE-C-31-M-12
  oval 1.2x2 hole 0.8x1.6: 0(-4.325,1.716) 0(4.325,1.716)
  oval 1.2x1.8 hole 0.8x1.4: 0(-4.325,-2.484) 0(4.325,-2.484)
  rect 0.3x1.3 smd: A1(-3.35,2.484) A4(-2.55,2.484) A5(-1.25,2.484) A6(-0.25,2.484) A7(0.25,2.484) A8(1.25,2.484) A9(2.55,2.484) A12(3.35,2.484) B1(3.05,2.484) B4(2.25,2.484) B5(1.75,2.484) B6(0.75,2.484) B7(-0.75,2.484) B8(-1.75,2.484) B9(-2.25,2.484) B12(-3.05,2.484)
WIFI-SMD_ESP32-WROOM-32E
  rect 0.95x2.1 smd: 1(-9.002,-9) 2(-7.732,-9) 3(-6.463,-9) 4(-5.192,-9) 5(-3.922,-9) 6(-2.652,-9) 7(-1.383,-9) 8(-0.113,-9) 9(1.157,-9) 10(2.428,-9) 11(3.697,-9) 12(4.968,-9) 13(6.237,-9) 14(7.508,-9) 25(7.508,9) 26(6.237,9) 27(4.968,9) 28(3.697,9) 29(2.428,9) 30(1.157,9) 31(-0.113,9) 32(-1.383,9) 33(-2.652,9) 34(-3.922,9) 35(-5.192,9) 36(-6.463,9) 37(-7.732,9) 38(-9.002,9)
  rect 2.1x0.95 smd: 15(9.002,-5.715) 16(9.002,-4.445) 17(9.002,-3.175) 18(9.002,-1.905) 19(9.002,-0.635) 20(9.002,0.635) 21(9.002,1.905) 22(9.002,3.175) 23(9.002,4.445) 24(9.002,5.715)
  rect 0.9x0.9 smd: 39(-2.721,-0.1) 39(-2.721,-1.5) 39(-2.721,-2.9) 39(-1.321,-0.1) 39(-1.321,-1.5) 39(-1.321,-2.9) 39(0.079,-0.1) 39(0.079,-1.5) 39(0.079,-2.9)
WQFN-28_L5.0-W5.0-P0.50-BL-EP3.2
  oval 0.28x0.9 smd: 1(-1.502,-2.5) 2(-1.001,-2.5) 3(-0.5,-2.5) 4(0,-2.5) 5(0.5,-2.5) 6(1,-2.5) 7(1.501,-2.5) 15(1.501,2.5) 16(1,2.5) 17(0.5,2.5) 18(0,2.5) 19(-0.5,2.5) 20(-1.001,2.5) 21(-1.502,2.5)
  oval 0.9x0.28 smd: 8(2.5,-1.502) 9(2.5,-1.001) 10(2.5,-0.5) 11(2.5,0) 12(2.5,0.5) 13(2.5,1) 14(2.5,1.501) 22(-2.5,1.501) 23(-2.5,1) 24(-2.5,0.5) 25(-2.5,0) 26(-2.5,-0.5) 27(-2.5,-1.001) 28(-2.5,-1.502)
  rect 3.2x3.2 smd: 29(0,0)

## Nets
3V3: C1.2 C2.2 C3.2 C5.1 C13.2 C14.2 C15.2 C17.1 C18.1 C21.1 C22.1 L2.2 LED1.1 LED3.1 NOREF#3.49 NOREF#9.46 NOREF#12.50 NOREF#21.46 Q1.2 R13.2 R14.2 R18.2 TP1.1 U2.9 U2.10 U3.1 U3.15 U3.16 U6.2 U7.2 U7.4 U8.1
GND: C1.1 C2.1 C3.1 C4.1 C5.2 C6.1 C9.1 C10.1 C11.1 C12.2 C13.1 C14.1 C15.1 C16.2 C17.2 C18.2 C19.2 C21.2 C22.2 D1.2 LED1.3 LED2.2 NOREF#2.40 NOREF#4.41 NOREF#8.43 NOREF#10.42 NOREF#14.55 NOREF#15.45 NOREF#17.45 R1.1 R11.1 R12.1 SW2.1 TP1.2 U2.6 U2.7 U2.8 U3.5 U3.9 U3.10 U3.14 U5.3 U5.29 U6.1 U6.15 U6.38 U6.39 U7.1 U8.4 USBC1.0 USBC1.A1 USBC1.A12 USBC1.B1 USBC1.B12 WB_IN_1.1 WB_IN_2.2
BATT_POS: C19.1 D1.1 U8.2 U8.3
BLINK_GREEN: R19.2 U6.27
BLINK_RED: R21.1 U6.13
CP_DTR: Q6.2 R7.1 U5.28
CP_RTS: Q5.2 R8.1 U5.24
CS: NOREF#7.48 U2.2
ESP_EN: C12.1 R9.2 R14.1 SW2.2 U6.3
ESP_IO0: R10.2 R13.1 U6.25
ESP_RXD: U5.26 U6.34
ESP_TXD: U5.25 U6.35
GYR_INT1: U2.12 U6.12
GYR_INT2: U2.11 U6.28
IO32: NOREF#13.53 U6.8
IO33: NOREF#11.54 U6.9
IO34: NOREF#20.51 U6.6
IO35: NOREF#16.52 U6.7
LED_DATA: R15.2 U6.14
S_A1: NOREF#19.40 U3.8 WB_IN_1.2 WB_OUT_1.1
S_A2: NOREF#18.40 U3.7 WB_IN_2.1 WB_OUT_2.2
S_AVDD: C4.2 NOREF#5.40 Q1.3 R2.2 U3.3 WB_OUT_1.2 WB_OUT_2.1
S_BASE: Q1.1 U3.2
S_DOUT: U3.12 U6.31
S_PD_SCK: U3.11 U6.30
S_VFB: R1.2 R2.1 U3.4
SCL_1: U2.1 U6.10
SD0: NOREF#6.47 U2.3
SDA_1: U2.4 U6.11
USB_CC1: R12.2 USBC1.A5
USB_CC2: R11.2 USBC1.B5
USB_D+: U5.4 USBC1.A6 USBC1.B6
USB_D-: U5.5 USBC1.A7 USBC1.B7
V_BUS: C10.2 C11.2 C16.1 U5.7 U5.8 U7.3 USBC1.A4 USBC1.A9 USBC1.B4 USBC1.B9
$1N365: BATTERY.1 SW1.3
$1N3382: LED1.4 R15.1
$1N3717: LED2.1 R18.1
$1N4432: LED3.3 R19.1
$1N4504: LED3.2 R21.2
$1N6597: C20.1 U8.6
$1N6598: C20.2 L2.1 U8.5
$1N7403: BATTERY.2 D1.4
$1N7407: D1.3 SW1.2
$2N1710: C6.2 U3.6
$2N2441: STRAIN 2.1 STRAIN 2.2
$2N3295: INNER 1.1 INNER 1.2
$2N3339: INNER 2.1 INNER 2.2
$2N7691: NOREF.44 U3.13
$2N9066: STRAIN 1.1 STRAIN 1.2
$3N1098: Q5.3 R9.1
$3N1099: Q6.3 R10.1
$3N1100: Q6.1 R8.2
$3N1101: Q5.1 R7.2
$3N1118: C9.2 U5.6

Pads without a net: LED1 2; LED3 4; SW1 1 4 5; SW2 3 4; U2 5; U5 1 2 9 10 11 12 13 14 15 16 17 18 19 20 21 22 23 27; U6 4 5 16 17 18 19 20 21 22 23 24 26 29 32 33 36 37; USBC1 A8 B8

## Via types
v1: diameter 1.2, hole 0.6, Top Layer to Bottom Layer, 35 vias
v2: diameter 0.8, hole 0.4, Top Layer to Bottom Layer, 21 vias

## Routing (per net, layer and track width the routed paths; a pad name or vN(x,y) marks a point on that pad's centre or on a via; arc(x,y) is an arc through that point)
3V3: length 98.2
  Top Layer w0.2: 112.51,39.54 U2.10 U2.9
  Top Layer w0.4: 25.05,52.95 v1(27.67,52.95) ; 25.05,52.95 v1(22.12,52.95) 21.23,52.06 18.36,52.06 ; 25.05,52.95 25.05,54.25 C17.1 ; 25.05,52.95 U7.4 ; U6.2 84.77,54.61 arc(84.78,54.68) C13.2 ; U8.1 22.1,34.54 v1(20.56,34.54) ; LED3.1 v1(65.64,29.3) 65.64,31.39 R13.2 ; R14.2 v1(15.48,40.76) ; LED1.1 55.13,37.75 C18.1 51.62,37.84 TP1.1 46.9,36.11 R18.2
  Top Layer w0.6: v1(31.93,29.71) C22.1 32.26,32.2 L2.2 ; C3.2 117.6,37.09 U3.15 ; C3.2 116.08,36.46 ; C3.2 117.09,36.33 ; NOREF#21.46 119.88,35.3 123.69,31.49 128.68,31.49 129.99,32.8 129.99,33.92 ; 116.08,36.46 117.09,36.33 ; 116.08,36.46 113.19,36.46 C2.2 ; U3.16 117.6,35.82 117.09,36.33 ; C5.1 129.99,33.92 ; 129.99,33.92 130.38,33.92 Q1.2 ; 129.99,33.92 U3.1 ; NOREF#12.50 NOREF#3.49 84.77,47.44 U6.2
GND: length 201.8
  Top Layer w0.2: v1(113.78,44.95) 113.78,44.95 113.78,41.79 ; U2.8 U2.7 113.78,41.79 ; 113.78,41.79 U2.6
  Top Layer w0.3: USBC1.B12 USBC1.A1 4.93,54.6 1.94,54.6 USBC1.0 ; U3.10 125.45,43.44 NOREF#10.42 127.99,40.9 U3.5 ; NOREF#14.55 32.51,53.45 U5.3 35.81,53.45 U5.29 38.47,50.79 38.47,49.78 36.69,48 v1(35.93,48) ; USBC1.A12 4.81,44.83 2.07,44.83 USBC1.0 ; U3.14 124.36,38.48 125.85,38.48 126.09,38.23 C5.2 ; R12.1 v1(10.07,49.56) R11.1
  Top Layer w0.4: U6.39 76.95,40.51 72.38,40.51 70.35,42.54 70.35,45.59 69.8,46.14 U6.15 ; U7.1 19.5,54.36 C17.2 ; v1(20.56,36.5) D1.2 18.2,36.52 15.99,38.73 12.48,38.73 C12.2 10.68,38.55 v1(7.02,38.55) SW2.1 ; v2(85.21,27.93) 86.04,28.77 U6.38 ; C2.1 C1.1 117.15,35.11 NOREF#17.45 ; U8.4 26.79,36.37 C21.2 ; LED2.2 47.82,41.19 TP1.2 50.92,40.38 51.55,41.02 53.27,41.02 C18.2 57.01,40.95 58.51,42.45 LED1.3 ; C16.2 v1(25.26,47.75) ; 18.38,54.35 17.03,54.35 v1(17.02,54.36) ; C9.1 v1(35.93,48) ; U6.1 86.04,54.42 arc(86.01,54.59) C13.1
  Top Layer w0.6: U3.10 121.89,43.44 NOREF#4.41 122.18,44.71 U3.9 ; C6.1 132.77,40.9 U3.5 ; C19.2 v1(26.48,30.54) 27.41,30.54 C22.2 C21.2 ; 160.38,34.91 156.96,31.49 NOREF#2.40 WB_IN_2.2 ; v2(84.44,41.92) U6.39 U6.39 ; 135.87,34.3 C4.1 ; 135.87,34.3 R1.1 ; 135.87,34.3 134.1,32.53 v2(134.1,32.51) ; U6.39 U6.39 U6.39 v2(84.44,43.32) 86.04,44.92 U6.1 ; U6.38 86.04,38.93 v2(84.44,40.52) U6.39 U6.39 U6.39 ; U3.14 118.97,38.36 118.74,38.6
  vias: v1(26.55,36.37)
BATT_POS: length 9.5
  Top Layer w0.6: U8.3 U8.2 23.61,32.06 C19.1 20.37,31.94 D1.1
BLINK_GREEN: length 6
  Top Layer w0.4: U6.27 72.07,26.75 R19.2
BLINK_RED: length 23.5
  Top Layer w0.4: R21.1 v1(69.98,29.2) ; U6.13 70.8,47.42 72.38,45.84 v1(72.38,43.81)
  Bottom Layer w0.4: v1(72.38,43.81) 70.85,42.29 70.85,30.08 v1(69.98,29.2)
CP_DTR: length 26.7
  Top Layer w0.3: U5.28 34.81,58.77 v1(34.79,58.8)
  Top Layer w0.4: R7.1 47.74,54.48 ; R7.1 47.69,54.01 49,52.7 52.68,52.7 Q6.2 ; R7.1 47.69,55.82 v1(48.25,56.38)
  Bottom Layer w0.3: v1(48.25,56.38) 45.07,59.56 35.55,59.56 v1(34.79,58.8)
CP_RTS: length 24.4
  Top Layer w0.3: U5.24 36.81,56.08 37.11,56.38 45.96,56.38 46.47,56.89
  Top Layer w0.4: R8.1 47.69,52.5 46.47,53.72 46.47,56.89 47.36,57.78 51.31,57.78 Q5.2
CS: length 6.8
  Top Layer w0.2: NOREF#7.48 119.24,41.4 117.89,40.04 U2.2
ESP_EN: length 102.1
  Top Layer w0.4: R9.2 v1(57.36,57.44) 57.83,57.91 80.89,57.91 83.5,55.29 U6.3 ; 12.76,40.63 R14.1 ; 12.76,40.63 C12.1 10.35,41.95 3.4,41.95 ; 12.76,40.63 12.76,41.1 16.24,44.57 39.99,44.57 44.44,49.02 v1(44.44,54.6)
  Bottom Layer w0.4: v1(57.36,57.44) 53.51,53.59 45.45,53.59 v1(44.44,54.6)
ESP_IO0: length 31.9
  Top Layer w0.4: v1(66.92,33.14) 66.92,31.44 R13.1 69.53,31.39 U6.25 ; 55.34,51.74 59.62,51.74 61.08,50.29 v1(61.08,49.4)
  Bottom Layer w0.4: v1(61.08,49.4) 61.08,36.32 64.25,33.14 v1(66.92,33.14)
ESP_RXD: length 69.6
  Top Layer w0.3: v1(80.89,35.55) 80.89,31.5 U6.34 ; U5.26 35.81,57.79 36.56,58.54 v1(38.09,58.54)
  Bottom Layer w0.3: v1(80.89,35.55) 81.65,36.32 81.65,44.83 81.01,45.46 70.47,45.46 63.62,52.32 41.52,52.32 38.09,55.75 v1(38.09,58.54)
ESP_TXD: length 67
  Top Layer w0.3: v1(82.28,34.79) 82.28,31.48 U6.35 ; v1(40.12,57.53) 37.2,57.53 36.31,56.64 U5.25
  Bottom Layer w0.3: v1(40.12,57.53) 40.12,56.51 43.68,52.95 63.74,52.95 70.6,46.1 81.27,46.1 82.28,45.08 v1(82.28,34.79)
GYR_INT1: length 73.5
  Top Layer w0.2: v2(72,52.45) 72.07,52.37 72.07,49.42 ; v2(106.41,38.86) 107.3,37.97 113.81,37.97 114.91,39.07 U2.12
  Bottom Layer w0.2: v2(72,52.45) 72,58.8 72.89,59.68 104.38,59.68 106.41,57.65 v2(106.41,38.86)
GYR_INT2: length 68
  Top Layer w0.2: U2.11 113.34,38.35 110.61,38.35 v2(109.97,38.98) ; v2(73.27,23.87) 73.27,31.35 73.34,31.42
  Bottom Layer w0.2: v2(73.27,23.87) 73.27,23.59 76.54,20.31 107.05,20.31 109.97,23.24 v2(109.97,38.98)
IO32: length 3.5
  Top Layer w0.4: NOREF#13.53 77.71,51.68 77.15,51.12 77.15,49.42
IO33: length 3.4
  Top Layer w0.4: NOREF#11.54 75.88,52.37 U6.9
IO34: length 4.3
  Top Layer w0.4: 79.69,49.42 79.69,50.49 81.9,52.7 NOREF#20.51
IO35: length 3.9
  Top Layer w0.4: NOREF#16.52 78.42,51.25 U6.7
LED_DATA: length 4.6
  Top Layer w0.4: R15.2 69.05,51.07 69.53,50.59 69.53,49.42
S_A1: length 59.5
  Top Layer w0.6: WB_OUT_1.1 162.3,43.55 NOREF#19.40 165.6,40.13 162.18,36.71 ; U3.8 130.81,44.71 130.81,45.48 v1(132.32,46.98) 132.92,47.58 148.42,47.58 153.79,52.95 159.25,52.95 v1(161.02,51.18)
  Bottom Layer w0.6: v1(161.02,51.18) 167.12,45.08 167.12,41.78 NOREF#19.40
S_A2: length 29.3
  Top Layer w0.6: 151.11,36.71 151.11,36.83 NOREF#18.40 ; NOREF#18.40 143.9,44.04 131.92,44.04 131.32,43.44 U3.7 ; NOREF#18.40 150.98,43.55 WB_OUT_2.2
S_AVDD: length 48.8
  Top Layer w0.6: v1(140.58,45.84) 149.72,45.84 152.13,48.25 154.93,48.25 155.56,47.62 ; 155.56,47.62 NOREF#5.40 157.09,48.64 160.38,45.34 ; 155.56,47.62 153.41,45.47 152.78,45.47 ; 134.09,38.36 136.5,38.36 136.77,38.09 ; 134.09,38.36 U3.3 ; 134.09,38.36 134.48,37.97 134.48,36.97 Q1.3 137.55,36.32 R2.2
  Bottom Layer w0.6: v1(136.77,38.36) 140.58,42.17 v1(140.58,45.84)
S_BASE: length 1.9
  Top Layer w0.6: U3.2 131.66,37.09 Q1.1
S_DOUT: length 77
  Top Layer w0.4: 120.64,41.14 120.51,41.14 v2(120.38,41.27) 122.67,41.27 123.04,40.9 U3.12 ; v2(77.08,23.87) 77.08,31.35 U6.31
  Bottom Layer w0.4: v2(120.38,41.27) 108.83,41.27 108.83,22.85 106.92,20.95 77.71,20.95 77.08,21.58 v2(77.08,23.87)
S_PD_SCK: length 76.1
  Top Layer w0.4: U3.11 124.23,42.16 v2(121.4,42.16) ; v2(75.93,26.66) 75.88,26.72 75.88,31.42
  Bottom Layer w0.4: v2(75.93,26.66) 78.22,24.38 78.22,22.09 78.73,21.58 106.41,21.58 107.81,22.98 107.81,41.9 108.07,42.16 v2(121.4,42.16)
S_VFB: length 14.2
  Top Layer w0.6: U3.4 137.9,39.63 139.67,37.86 R2.1 139.67,34.92 R1.2
SCL_1: length 71.4
  Top Layer w0.2: 74.61,49.42 74.61,51.1 74.16,51.56 74.16,55.37 v2(74.28,55.49) ; v2(105.53,37.59) 114.16,37.59 115.53,38.96 U2.1
  Bottom Layer w0.2: v2(105.53,37.59) 105.53,57.91 105.02,58.41 75.63,58.41 75.43,58.21 75.43,56.64 v2(74.28,55.49)
SD0: length 5.2
  Top Layer w0.2: U2.3 116.88,40.54 117.08,40.74 117.08,43.56 117.63,44.1
SDA_1: length 67.2
  Top Layer w0.3: v2(73.39,58.92) 73.52,59.05 111.11,59.05 115.53,54.63 U2.4 ; v2(73.39,57.02) 73.39,49.37 U6.11
  Bottom Layer w0.3: v2(73.39,58.92) v2(73.39,57.02)
USB_CC1: length 2.8
  Top Layer w0.3: USBC1.A5 9.19,51.03 R12.2
USB_CC2: length 2.8
  Top Layer w0.3: USBC1.B5 9.11,48.03 R11.2
USB_D+: length 39.5
  Top Layer w0.3: USBC1.A6 7.74,50.03 v2(8.12,49.65) 8.12,49.4 7.74,49.02 6.42,49.02 USBC1.B6 ; U5.4 31.1,52.95 v2(28.18,55.87)
  Bottom Layer w0.3: v2(28.18,55.87) 28.18,57.61 27.88,57.91 10.66,57.91 8.12,55.37 v2(8.12,49.65)
USB_D-: length 40.5
  Top Layer w0.3: USBC1.B7 5.06,50.53 4.69,50.16 4.69,49.91 5.06,49.53 USBC1.A7 ; v2(28.56,51.56) 29.46,52.45 U5.5
  Bottom Layer w0.3: 4.69,50.16 8.97,45.88 27.84,45.88 28.56,46.6 v2(28.56,51.56)
  vias: v2(4.56,50.03)
V_BUS: length 50.2
  Top Layer w0.3: 18.59,49.97 19.23,49.97 19.56,49.64 20.27,49.64 ; 18.59,49.97 15.42,46.8 8.3,46.8 7.61,47.49 6.67,47.49 USBC1.A9 ; 18.59,49.97 18.34,49.97 15.98,52.33 USBC1.A4 ; U5.7 34.37,50.9 34.37,50.59 ; v1(30.09,50.54) 29.2,49.65 23.42,49.65 C16.1 ; 34.37,50.01 C11.2 C10.2 ; 34.37,50.01 34.37,50.59 ; 34.37,50.01 U5.8 ; 34.37,50.59 v1(33.01,50.59)
  Top Layer w0.4: C16.1 19.5,49.76 U7.3
  Bottom Layer w0.3: v1(30.09,50.54) 32.96,50.54 v1(33.01,50.59)
$1N365: length 12.5
  Top Layer w0.4: SW1.3 2.69,27.43 14.47,27.43 BATTERY.1
$1N3382: length 13.9
  Top Layer w0.4: R15.1 62.98,47.75 58.54,47.75 55.51,44.72 LED1.4
$1N3717: length 1.9
  Top Layer w0.4: LED2.1 R18.1
$1N4432: length 3.3
  Top Layer w0.4: LED3.3 69.59,25.9 R19.1
$1N4504: length 2.4
  Top Layer w0.4: LED3.2 67.54,26.67 R21.2
$1N6597: length 2.5
  Top Layer w0.4: U8.6 22.4,36.63 C20.1
$1N6598: length 6.9
  Top Layer w0.4: U8.5 23.61,38.54 C20.2 27.91,38.73 L2.1
$1N7403: length 5.8
  Top Layer w0.4: D1.4 12,31.8 13.32,30.47 BATTERY.2
$1N7407: length 15.3
  Top Layer w0.4: D1.3 11.94,36.44 9.77,36.44 7.61,34.28 7.61,30.09 6.97,29.46 2.23,29.46 2.1,29.33
$2N1710: length 2.9
  Top Layer w0.6: U3.6 132.77,42.17 C6.2
$2N2441: length 76668.6
  Bottom Layer w0.1: 172.82,67.74 423.54,67.74 423.54,67.56 173.54,67.56 173.54,67.38 423.54,67.38 423.54,67.2 173.54,67.2 173.54,67.02 423.54,67.02 423.54,66.84 173.54,66.84 173.54,66.66 423.54,66.66 423.54,66.48 173.54,66.48 173.54,66.3 423.54,66.3 423.54,66.12 173.54,66.12 173.54,65.94 423.54,65.94 423.54,65.76 173.54,65.76 173.54,65.58 423.54,65.58 423.54,65.4 173.54,65.4 173.54,65.22 423.54,65.22 423.54,65.04 173.54,65.04 173.54,64.86 423.54,64.86 423.54,64.68 173.54,64.68 173.54,64.5 423.54,64.5 423.54,64.32 173.54,64.32 173.54,64.14 423.54,64.14 423.54,63.96 173.54,63.96 173.54,63.78 423.54,63.78 423.54,63.6 173.54,63.6 173.54,63.42 423.54,63.42 423.54,63.24 173.54,63.24 173.54,63.06 423.54,63.06 423.54,62.88 173.54,62.88 173.54,62.7 423.54,62.7 423.54,62.52 173.54,62.52 173.54,62.34 423.54,62.34 423.54,62.16 173.54,62.16 173.54,61.98 423.54,61.98 423.54,61.8 173.54,61.8 173.54,61.62 423.54,61.62 423.54,61.44 173.54,61.44 173.54,61.26 423.54,61.26 423.54,61.08 173.54,61.08 173.54,60.9 423.54,60.9 423.54,60.72 173.54,60.72 173.54,60.54 423.54,60.54 423.54,60.36 173.54,60.36 173.54,60.18 423.54,60.18 423.54,60 173.54,60 173.54,59.82 423.54,59.82 423.54,59.64 173.54,59.64 173.54,59.46 423.54,59.46 423.54,59.28 173.54,59.28 173.54,59.1 423.54,59.1 423.54,58.92 173.54,58.92 173.54,58.74 423.54,58.74 423.54,58.56 173.54,58.56 173.54,58.38 423.54,58.38 423.54,58.2 173.54,58.2 173.54,58.02 423.54,58.02 423.54,57.84 173.54,57.84 173.54,57.66 423.54,57.66 423.54,57.48 173.54,57.48 173.54,57.3 423.54,57.3 423.54,57.12 173.54,57.12 173.54,56.94 423.54,56.94 423.54,56.76 173.54,56.76 173.54,56.58 423.54,56.58 423.54,56.4 173.54,56.4 173.54,56.22 423.54,56.22 423.54,56.04 173.54,56.04 173.54,55.86 423.54,55.86 423.54,55.68 173.54,55.68 173.54,55.5 423.54,55.5 423.54,55.32 173.54,55.32 173.54,55.14 423.54,55.14 423.54,54.96 173.54,54.96 173.54,54.78 423.54,54.78 423.54,54.6 173.54,54.6 173.54,54.42 423.54,54.42 423.54,54.24 173.54,54.24 173.54,54.06 423.54,54.06 423.54,53.88 173.54,53.88 173.54,53.7 423.54,53.7 423.54,53.52 173.54,53.52 173.54,53.34 423.54,53.34 423.54,53.16 173.54,53.16 173.54,52.98 423.54,52.98 423.54,52.8 173.54,52.8 173.54,52.62 423.54,52.62 423.54,52.44 173.54,52.44 173.54,52.26 423.54,52.26 423.54,52.08 173.54,52.08 173.54,51.9 423.54,51.9 423.54,51.72 173.54,51.72 173.54,51.54 423.54,51.54 423.54,51.36 173.54,51.36 173.54,51.18 423.54,51.18 423.54,51 173.54,51 173.54,50.82 423.54,50.82 423.54,50.64 173.54,50.64 173.54,50.46 423.54,50.46 423.54,50.28 173.54,50.28 173.54,50.1 423.54,50.1 423.54,49.92 173.54,49.92 173.54,49.74 423.54,49.74 423.54,49.56 173.54,49.56 173.54,49.38 423.54,49.38 423.54,49.2 173.54,49.2 173.54,49.02 423.54,49.02 423.54,48.84 173.54,48.84 173.54,48.66 423.54,48.66 423.54,48.48 173.54,48.48 173.54,48.3 423.54,48.3 423.54,48.12 173.54,48.12 173.54,47.94 423.54,47.94 423.54,47.76 173.54,47.76 173.54,47.58 423.54,47.58 423.54,47.4 173.54,47.4 173.54,47.22 423.54,47.22 423.54,47.04 173.54,47.04 173.54,46.86 423.54,46.86 423.54,46.68 173.54,46.68 173.54,46.5 423.54,46.5 423.54,46.32 173.54,46.32 173.54,46.14 423.54,46.14 423.54,45.96 173.54,45.96 173.54,45.78 423.54,45.78 423.54,45.6 173.54,45.6 173.54,45.42 423.54,45.42 423.54,45.24 173.54,45.24 173.54,45.06 423.54,45.06 423.54,44.88 173.54,44.88 173.54,44.7 423.54,44.7 423.54,44.52 173.54,44.52 173.54,44.34 423.54,44.34 423.54,44.16 173.54,44.16 173.54,43.98 423.54,43.98 423.54,43.8 173.54,43.8 173.54,43.62 423.54,43.62 423.54,43.44 173.54,43.44 173.54,43.26 423.54,43.26 423.54,43.08 173.54,43.08 173.54,42.9 423.54,42.9 423.54,42.72 173.54,42.72 173.54,42.54 423.54,42.54 423.54,42.36 173.54,42.36 173.54,42.18 423.54,42.18 423.54,42 173.54,42 173.54,41.82 423.54,41.82 423.54,41.64 173.54,41.64 173.54,41.46 423.54,41.46 423.54,41.28 173.54,41.28 173.54,41.1 423.54,41.1 423.54,40.92 173.54,40.92 173.54,40.74 423.54,40.74 423.54,40.56 173.54,40.56 173.54,40.38 423.54,40.38 423.54,40.2 173.54,40.2 173.54,40.02 423.54,40.02 423.54,39.84 173.54,39.84 173.54,39.66 423.54,39.66 423.54,39.48 173.54,39.48 173.54,39.3 423.54,39.3 423.54,39.12 173.54,39.12 173.54,38.94 423.54,38.94 423.54,38.76 173.54,38.76 173.54,38.58 423.54,38.58 423.54,38.4 173.54,38.4 173.54,38.22 423.54,38.22 423.54,38.04 173.54,38.04 173.54,37.86 423.54,37.86 423.54,37.68 173.54,37.68 173.54,37.5 423.54,37.5 423.54,37.32 173.54,37.32 173.54,37.14 423.54,37.14 423.54,36.96 173.54,36.96 173.54,36.78 423.54,36.78 423.54,36.6 173.54,36.6 173.54,36.42 423.54,36.42 423.54,36.24 173.54,36.24 173.54,36.06 423.54,36.06 423.54,35.88 173.54,35.88 173.54,35.7 423.54,35.7 423.54,35.52 173.54,35.52 173.54,35.34 423.54,35.34 423.54,35.16 173.54,35.16 173.54,34.98 423.54,34.98 423.54,34.8 173.54,34.8 173.54,34.62 423.54,34.62 423.54,34.44 173.54,34.44 173.54,34.26 423.54,34.26 423.54,34.08 173.54,34.08 173.54,33.9 423.54,33.9 423.54,33.72 173.54,33.72 173.54,33.54 423.54,33.54 423.54,33.36 173.54,33.36 173.54,33.18 423.54,33.18 423.54,33 173.54,33 173.54,32.82 423.54,32.82 423.54,32.64 173.54,32.64 173.54,32.46 423.54,32.46 423.54,32.28 173.54,32.28 173.54,32.1 423.54,32.1 423.54,31.92 173.54,31.92 173.54,31.74 423.54,31.74 423.54,31.56 173.54,31.56 173.54,31.38 423.54,31.38 423.54,31.2 173.54,31.2 173.54,31.02 423.54,31.02 423.54,30.84 173.54,30.84 173.54,30.66 423.54,30.66 423.54,30.48 173.54,30.48 173.54,30.3 423.54,30.3 423.54,30.12 173.54,30.12 173.54,29.94 423.54,29.94 423.54,29.76 173.54,29.76 173.54,29.58 423.54,29.58 423.54,29.4 173.54,29.4 173.54,29.22 423.54,29.22 423.54,29.04 173.54,29.04 173.54,28.86 423.54,28.86 423.54,28.68 173.54,28.68 173.54,28.5 423.54,28.5 423.54,28.32 173.54,28.32 173.54,28.14 423.54,28.14 423.54,27.96 173.54,27.96 173.54,27.78 423.54,27.78 423.54,27.6 173.54,27.6 173.54,27.42 423.54,27.42 423.54,27.24 173.54,27.24 173.54,27.06 423.54,27.06 423.54,26.88 173.54,26.88 173.54,26.7 423.54,26.7 423.54,26.52 173.54,26.52 173.54,26.34 423.54,26.34 423.54,26.16 173.54,26.16 173.54,25.98 423.54,25.98 423.54,25.8 173.54,25.8 173.54,25.62 423.54,25.62 423.54,25.44 173.54,25.44 173.54,25.26 423.54,25.26 423.54,25.08 173.54,25.08 173.54,24.9 423.54,24.9 423.54,24.72 173.54,24.72 173.54,24.54 423.54,24.54 423.54,24.36 173.54,24.36 173.54,24.18 423.54,24.18 423.54,24 173.54,24 173.54,23.82 423.54,23.82 423.54,23.64 173.54,23.64 173.54,23.46 423.54,23.46 423.54,23.28 173.54,23.28 173.54,23.1 423.54,23.1 423.54,22.92 173.54,22.92 173.54,22.74 423.54,22.74 423.54,22.56 173.54,22.56 173.54,22.38 423.54,22.38 423.54,22.2 173.54,22.2 173.54,22.02 423.54,22.02 423.54,21.84 173.54,21.84 173.54,21.66 423.54,21.66 423.54,21.48 173.54,21.48 173.54,21.3 423.54,21.3 423.54,21.12 173.54,21.12 173.54,20.94 423.54,20.94 423.54,20.76 173.54,20.76 173.54,20.58 423.54,20.58 423.54,20.4 173.54,20.4 173.54,20.22 423.54,20.22 423.54,20.04 173.54,20.04 173.54,19.86 423.54,19.86 423.54,19.68 173.54,19.68 173.54,19.5 423.54,19.5 423.54,19.32 173.54,19.32 173.54,19.14 423.54,19.14 423.54,18.96 173.54,18.96 173.54,18.78 423.54,18.78 423.54,18.6 173.54,18.6 173.54,18.42 423.54,18.42 423.54,18.24 173.54,18.24 173.54,18.06 423.54,18.06 423.54,17.88 173.54,17.88 173.54,17.7 423.54,17.7 423.54,17.52 173.54,17.52 173.54,17.34 423.54,17.34 423.54,17.16 173.54,17.16 173.54,16.98 423.54,16.98 423.54,16.8 173.54,16.8 173.54,16.62 423.54,16.62 423.54,16.44 173.54,16.44 173.54,16.26 423.54,16.26 423.54,16.08 173.54,16.08 173.54,15.9 423.54,15.9 423.54,15.72 173.54,15.72 173.54,15.54 423.54,15.54 423.54,15.36 173.54,15.36 173.54,15.18 423.54,15.18 423.54,15 173.54,15 173.54,14.82 423.54,14.82 423.54,14.64 173.54,14.64 173.54,14.46 423.54,14.46 423.54,14.28 173.54,14.28 173.54,14.1 423.54,14.1 423.54,13.92 173.54,13.92 173.54,13.74 423.54,13.74 423.54,13.56 173.54,13.56 173.54,13.38 423.54,13.38 423.54,13.2 173.54,13.2 173.54,13.02 423.54,13.02 423.54,12.84 172.82,12.84
  Bottom Layer w0.3: 173.09,67.69 172.58,67.18 172.58,60.96 168.64,57.02 147.94,57.02 143.26,52.33 143.26,51.91 144.25,50.91 ; 172.96,12.82 172.84,12.82 172.58,13.08 172.58,54.22 170.55,56.26 149.21,56.26 146.05,53.09 STRAIN 2.2
$2N3295: length 76612.3
  GND w0.1: 172.82,67.83 423.55,67.83 423.55,67.65 173.55,67.65 173.55,67.47 423.55,67.47 423.55,67.29 173.55,67.29 173.55,67.11 423.55,67.11 423.55,66.93 173.55,66.93 173.55,66.75 423.55,66.75 423.55,66.57 173.55,66.57 173.55,66.39 423.55,66.39 423.55,66.21 173.55,66.21 173.55,66.03 423.55,66.03 423.55,65.85 173.55,65.85 173.55,65.67 423.55,65.67 423.55,65.49 173.55,65.49 173.55,65.31 423.55,65.31 423.55,65.13 173.55,65.13 173.55,64.95 423.55,64.95 423.55,64.77 173.55,64.77 173.55,64.59 423.55,64.59 423.55,64.41 173.55,64.41 173.55,64.23 423.55,64.23 423.55,64.05 173.55,64.05 173.55,63.87 423.55,63.87 423.55,63.69 173.55,63.69 173.55,63.51 423.55,63.51 423.55,63.33 173.55,63.33 173.55,63.15 423.55,63.15 423.55,62.97 173.55,62.97 173.55,62.79 423.55,62.79 423.55,62.61 173.55,62.61 173.55,62.43 423.55,62.43 423.55,62.25 173.55,62.25 173.55,62.07 423.55,62.07 423.55,61.89 173.55,61.89 173.55,61.71 423.55,61.71 423.55,61.53 173.55,61.53 173.55,61.35 423.55,61.35 423.55,61.17 173.55,61.17 173.55,60.99 423.55,60.99 423.55,60.81 173.55,60.81 173.55,60.63 423.55,60.63 423.55,60.45 173.55,60.45 173.55,60.27 423.55,60.27 423.55,60.09 173.55,60.09 173.55,59.91 423.55,59.91 423.55,59.73 173.55,59.73 173.55,59.55 423.55,59.55 423.55,59.37 173.55,59.37 173.55,59.19 423.55,59.19 423.55,59.01 173.55,59.01 173.55,58.83 423.55,58.83 423.55,58.65 173.55,58.65 173.55,58.47 423.55,58.47 423.55,58.29 173.55,58.29 173.55,58.11 423.55,58.11 423.55,57.93 173.55,57.93 173.55,57.75 423.55,57.75 423.55,57.57 173.55,57.57 173.55,57.39 423.55,57.39 423.55,57.21 173.55,57.21 173.55,57.03 423.55,57.03 423.55,56.85 173.55,56.85 173.55,56.67 423.55,56.67 423.55,56.49 173.55,56.49 173.55,56.31 423.55,56.31 423.55,56.13 173.55,56.13 173.55,55.95 423.55,55.95 423.55,55.77 173.55,55.77 173.55,55.59 423.55,55.59 423.55,55.41 173.55,55.41 173.55,55.23 423.55,55.23 423.55,55.05 173.55,55.05 173.55,54.87 423.55,54.87 423.55,54.69 173.55,54.69 173.55,54.51 423.55,54.51 423.55,54.33 173.55,54.33 173.55,54.15 423.55,54.15 423.55,53.97 173.55,53.97 173.55,53.79 423.55,53.79 423.55,53.61 173.55,53.61 173.55,53.43 423.55,53.43 423.55,53.25 173.55,53.25 173.55,53.07 423.55,53.07 423.55,52.89 173.55,52.89 173.55,52.71 423.55,52.71 423.55,52.53 173.55,52.53 173.55,52.35 423.55,52.35 423.55,52.17 173.55,52.17 173.55,51.99 423.55,51.99 423.55,51.81 173.55,51.81 173.55,51.63 423.55,51.63 423.55,51.45 173.55,51.45 173.55,51.27 423.55,51.27 423.55,51.09 173.55,51.09 173.55,50.91 423.55,50.91 423.55,50.73 173.55,50.73 173.55,50.55 423.55,50.55 423.55,50.37 173.55,50.37 173.55,50.19 423.55,50.19 423.55,50.01 173.55,50.01 173.55,49.83 423.55,49.83 423.55,49.65 173.55,49.65 173.55,49.47 423.55,49.47 423.55,49.29 173.55,49.29 173.55,49.11 423.55,49.11 423.55,48.93 173.55,48.93 173.55,48.75 423.55,48.75 423.55,48.57 173.55,48.57 173.55,48.39 423.55,48.39 423.55,48.21 173.55,48.21 173.55,48.03 423.55,48.03 423.55,47.85 173.55,47.85 173.55,47.67 423.55,47.67 423.55,47.49 173.55,47.49 173.55,47.31 423.55,47.31 423.55,47.13 173.55,47.13 173.55,46.95 423.55,46.95 423.55,46.77 173.55,46.77 173.55,46.59 423.55,46.59 423.55,46.41 173.55,46.41 173.55,46.23 423.55,46.23 423.55,46.05 173.55,46.05 173.55,45.87 423.55,45.87 423.55,45.69 173.55,45.69 173.55,45.51 423.55,45.51 423.55,45.33 173.55,45.33 173.55,45.15 423.55,45.15 423.55,44.97 173.55,44.97 173.55,44.79 423.55,44.79 423.55,44.61 173.55,44.61 173.55,44.43 423.55,44.43 423.55,44.25 173.55,44.25 173.55,44.07 423.55,44.07 423.55,43.89 173.55,43.89 173.55,43.71 423.55,43.71 423.55,43.53 173.55,43.53 173.55,43.35 423.55,43.35 423.55,43.17 173.55,43.17 173.55,42.99 423.55,42.99 423.55,42.81 173.55,42.81 173.55,42.63 423.55,42.63 423.55,42.45 173.55,42.45 173.55,42.27 423.55,42.27 423.55,42.09 173.55,42.09 173.55,41.91 423.55,41.91 423.55,41.73 173.55,41.73 173.55,41.55 423.55,41.55 423.55,41.37 173.55,41.37 173.55,41.19 423.55,41.19 423.55,41.01 173.55,41.01 173.55,40.83 423.55,40.83 423.55,40.65 173.55,40.65 173.55,40.47 423.55,40.47 423.55,40.29 173.55,40.29 173.55,40.11 423.55,40.11 423.55,39.93 173.55,39.93 173.55,39.75 423.55,39.75 423.55,39.57 173.55,39.57 173.55,39.39 423.55,39.39 423.55,39.21 173.55,39.21 173.55,39.03 423.55,39.03 423.55,38.85 173.55,38.85 173.55,38.67 423.55,38.67 423.55,38.49 173.55,38.49 173.55,38.31 423.55,38.31 423.55,38.13 173.55,38.13 173.55,37.95 423.55,37.95 423.55,37.77 173.55,37.77 173.55,37.59 423.55,37.59 423.55,37.41 173.55,37.41 173.55,37.23 423.55,37.23 423.55,37.05 173.55,37.05 173.55,36.87 423.55,36.87 423.55,36.69 173.55,36.69 173.55,36.51 423.55,36.51 423.55,36.33 173.55,36.33 173.55,36.15 423.55,36.15 423.55,35.97 173.55,35.97 173.55,35.79 423.55,35.79 423.55,35.61 173.55,35.61 173.55,35.43 423.55,35.43 423.55,35.25 173.55,35.25 173.55,35.07 423.55,35.07 423.55,34.89 173.55,34.89 173.55,34.71 423.55,34.71 423.55,34.53 173.55,34.53 173.55,34.35 423.55,34.35 423.55,34.17 173.55,34.17 173.55,33.99 423.55,33.99 423.55,33.81 173.55,33.81 173.55,33.63 423.55,33.63 423.55,33.45 173.55,33.45 173.55,33.27 423.55,33.27 423.55,33.09 173.55,33.09 173.55,32.91 423.55,32.91 423.55,32.73 173.55,32.73 173.55,32.55 423.55,32.55 423.55,32.37 173.55,32.37 173.55,32.19 423.55,32.19 423.55,32.01 173.55,32.01 173.55,31.83 423.55,31.83 423.55,31.65 173.55,31.65 173.55,31.47 423.55,31.47 423.55,31.29 173.55,31.29 173.55,31.11 423.55,31.11 423.55,30.93 173.55,30.93 173.55,30.75 423.55,30.75 423.55,30.57 173.55,30.57 173.55,30.39 423.55,30.39 423.55,30.21 173.55,30.21 173.55,30.03 423.55,30.03 423.55,29.85 173.55,29.85 173.55,29.67 423.55,29.67 423.55,29.49 173.55,29.49 173.55,29.31 423.55,29.31 423.55,29.13 173.55,29.13 173.55,28.95 423.55,28.95 423.55,28.77 173.55,28.77 173.55,28.59 423.55,28.59 423.55,28.41 173.55,28.41 173.55,28.23 423.55,28.23 423.55,28.05 173.55,28.05 173.55,27.87 423.55,27.87 423.55,27.69 173.55,27.69 173.55,27.51 423.55,27.51 423.55,27.33 173.55,27.33 173.55,27.15 423.55,27.15 423.55,26.97 173.55,26.97 173.55,26.79 423.55,26.79 423.55,26.61 173.55,26.61 173.55,26.43 423.55,26.43 423.55,26.25 173.55,26.25 173.55,26.07 423.55,26.07 423.55,25.89 173.55,25.89 173.55,25.71 423.55,25.71 423.55,25.53 173.55,25.53 173.55,25.35 423.55,25.35 423.55,25.17 173.55,25.17 173.55,24.99 423.55,24.99 423.55,24.81 173.55,24.81 173.55,24.63 423.55,24.63 423.55,24.45 173.55,24.45 173.55,24.27 423.55,24.27 423.55,24.09 173.55,24.09 173.55,23.91 423.55,23.91 423.55,23.73 173.55,23.73 173.55,23.55 423.55,23.55 423.55,23.37 173.55,23.37 173.55,23.19 423.55,23.19 423.55,23.01 173.55,23.01 173.55,22.83 423.55,22.83 423.55,22.65 173.55,22.65 173.55,22.47 423.55,22.47 423.55,22.29 173.55,22.29 173.55,22.11 423.55,22.11 423.55,21.93 173.55,21.93 173.55,21.75 423.55,21.75 423.55,21.57 173.55,21.57 173.55,21.39 423.55,21.39 423.55,21.21 173.55,21.21 173.55,21.03 423.55,21.03 423.55,20.85 173.55,20.85 173.55,20.67 423.55,20.67 423.55,20.49 173.55,20.49 173.55,20.31 423.55,20.31 423.55,20.13 173.55,20.13 173.55,19.95 423.55,19.95 423.55,19.77 173.55,19.77 173.55,19.59 423.55,19.59 423.55,19.41 173.55,19.41 173.55,19.23 423.55,19.23 423.55,19.05 173.55,19.05 173.55,18.87 423.55,18.87 423.55,18.69 173.55,18.69 173.55,18.51 423.55,18.51 423.55,18.33 173.55,18.33 173.55,18.15 423.55,18.15 423.55,17.97 173.55,17.97 173.55,17.79 423.55,17.79 423.55,17.61 173.55,17.61 173.55,17.43 423.55,17.43 423.55,17.25 173.55,17.25 173.55,17.07 423.55,17.07 423.55,16.89 173.55,16.89 173.55,16.71 423.55,16.71 423.55,16.53 173.55,16.53 173.55,16.35 423.55,16.35 423.55,16.17 173.55,16.17 173.55,15.99 423.55,15.99 423.55,15.81 173.55,15.81 173.55,15.63 423.55,15.63 423.55,15.45 173.55,15.45 173.55,15.27 423.55,15.27 423.55,15.09 173.55,15.09 173.55,14.91 423.55,14.91 423.55,14.73 173.55,14.73 173.55,14.55 423.55,14.55 423.55,14.37 173.55,14.37 173.55,14.19 423.55,14.19 423.55,14.01 173.55,14.01 173.55,13.83 423.55,13.83 423.55,13.65 173.55,13.65 173.55,13.47 423.55,13.47 423.55,13.29 173.55,13.29 173.55,13.11 423.55,13.11 423.55,12.93 172.82,12.93
  GND w0.3: 172.84,12.95 172.84,23.47 168.25,28.05 ; 170.05,29.85 172.45,32.25 172.45,67.43 172.84,67.81
$2N3339: length 76667.4
  3V3 w0.1: 172.82,67.74 423.54,67.74 423.54,67.56 173.54,67.56 173.54,67.38 423.54,67.38 423.54,67.2 173.54,67.2 173.54,67.02 423.54,67.02 423.54,66.84 173.54,66.84 173.54,66.66 423.54,66.66 423.54,66.48 173.54,66.48 173.54,66.3 423.54,66.3 423.54,66.12 173.54,66.12 173.54,65.94 423.54,65.94 423.54,65.76 173.54,65.76 173.54,65.58 423.54,65.58 423.54,65.4 173.54,65.4 173.54,65.22 423.54,65.22 423.54,65.04 173.54,65.04 173.54,64.86 423.54,64.86 423.54,64.68 173.54,64.68 173.54,64.5 423.54,64.5 423.54,64.32 173.54,64.32 173.54,64.14 423.54,64.14 423.54,63.96 173.54,63.96 173.54,63.78 423.54,63.78 423.54,63.6 173.54,63.6 173.54,63.42 423.54,63.42 423.54,63.24 173.54,63.24 173.54,63.06 423.54,63.06 423.54,62.88 173.54,62.88 173.54,62.7 423.54,62.7 423.54,62.52 173.54,62.52 173.54,62.34 423.54,62.34 423.54,62.16 173.54,62.16 173.54,61.98 423.54,61.98 423.54,61.8 173.54,61.8 173.54,61.62 423.54,61.62 423.54,61.44 173.54,61.44 173.54,61.26 423.54,61.26 423.54,61.08 173.54,61.08 173.54,60.9 423.54,60.9 423.54,60.72 173.54,60.72 173.54,60.54 423.54,60.54 423.54,60.36 173.54,60.36 173.54,60.18 423.54,60.18 423.54,60 173.54,60 173.54,59.82 423.54,59.82 423.54,59.64 173.54,59.64 173.54,59.46 423.54,59.46 423.54,59.28 173.54,59.28 173.54,59.1 423.54,59.1 423.54,58.92 173.54,58.92 173.54,58.74 423.54,58.74 423.54,58.56 173.54,58.56 173.54,58.38 423.54,58.38 423.54,58.2 173.54,58.2 173.54,58.02 423.54,58.02 423.54,57.84 173.54,57.84 173.54,57.66 423.54,57.66 423.54,57.48 173.54,57.48 173.54,57.3 423.54,57.3 423.54,57.12 173.54,57.12 173.54,56.94 423.54,56.94 423.54,56.76 173.54,56.76 173.54,56.58 423.54,56.58 423.54,56.4 173.54,56.4 173.54,56.22 423.54,56.22 423.54,56.04 173.54,56.04 173.54,55.86 423.54,55.86 423.54,55.68 173.54,55.68 173.54,55.5 423.54,55.5 423.54,55.32 173.54,55.32 173.54,55.14 423.54,55.14 423.54,54.96 173.54,54.96 173.54,54.78 423.54,54.78 423.54,54.6 173.54,54.6 173.54,54.42 423.54,54.42 423.54,54.24 173.54,54.24 173.54,54.06 423.54,54.06 423.54,53.88 173.54,53.88 173.54,53.7 423.54,53.7 423.54,53.52 173.54,53.52 173.54,53.34 423.54,53.34 423.54,53.16 173.54,53.16 173.54,52.98 423.54,52.98 423.54,52.8 173.54,52.8 173.54,52.62 423.54,52.62 423.54,52.44 173.54,52.44 173.54,52.26 423.54,52.26 423.54,52.08 173.54,52.08 173.54,51.9 423.54,51.9 423.54,51.72 173.54,51.72 173.54,51.54 423.54,51.54 423.54,51.36 173.54,51.36 173.54,51.18 423.54,51.18 423.54,51 173.54,51 173.54,50.82 423.54,50.82 423.54,50.64 173.54,50.64 173.54,50.46 423.54,50.46 423.54,50.28 173.54,50.28 173.54,50.1 423.54,50.1 423.54,49.92 173.54,49.92 173.54,49.74 423.54,49.74 423.54,49.56 173.54,49.56 173.54,49.38 423.54,49.38 423.54,49.2 173.54,49.2 173.54,49.02 423.54,49.02 423.54,48.84 173.54,48.84 173.54,48.66 423.54,48.66 423.54,48.48 173.54,48.48 173.54,48.3 423.54,48.3 423.54,48.12 173.54,48.12 173.54,47.94 423.54,47.94 423.54,47.76 173.54,47.76 173.54,47.58 423.54,47.58 423.54,47.4 173.54,47.4 173.54,47.22 423.54,47.22 423.54,47.04 173.54,47.04 173.54,46.86 423.54,46.86 423.54,46.68 173.54,46.68 173.54,46.5 423.54,46.5 423.54,46.32 173.54,46.32 173.54,46.14 423.54,46.14 423.54,45.96 173.54,45.96 173.54,45.78 423.54,45.78 423.54,45.6 173.54,45.6 173.54,45.42 423.54,45.42 423.54,45.24 173.54,45.24 173.54,45.06 423.54,45.06 423.54,44.88 173.54,44.88 173.54,44.7 423.54,44.7 423.54,44.52 173.54,44.52 173.54,44.34 423.54,44.34 423.54,44.16 173.54,44.16 173.54,43.98 423.54,43.98 423.54,43.8 173.54,43.8 173.54,43.62 423.54,43.62 423.54,43.44 173.54,43.44 173.54,43.26 423.54,43.26 423.54,43.08 173.54,43.08 173.54,42.9 423.54,42.9 423.54,42.72 173.54,42.72 173.54,42.54 423.54,42.54 423.54,42.36 173.54,42.36 173.54,42.18 423.54,42.18 423.54,42 173.54,42 173.54,41.82 423.54,41.82 423.54,41.64 173.54,41.64 173.54,41.46 423.54,41.46 423.54,41.28 173.54,41.28 173.54,41.1 423.54,41.1 423.54,40.92 173.54,40.92 173.54,40.74 423.54,40.74 423.54,40.56 173.54,40.56 173.54,40.38 423.54,40.38 423.54,40.2 173.54,40.2 173.54,40.02 423.54,40.02 423.54,39.84 173.54,39.84 173.54,39.66 423.54,39.66 423.54,39.48 173.54,39.48 173.54,39.3 423.54,39.3 423.54,39.12 173.54,39.12 173.54,38.94 423.54,38.94 423.54,38.76 173.54,38.76 173.54,38.58 423.54,38.58 423.54,38.4 173.54,38.4 173.54,38.22 423.54,38.22 423.54,38.04 173.54,38.04 173.54,37.86 423.54,37.86 423.54,37.68 173.54,37.68 173.54,37.5 423.54,37.5 423.54,37.32 173.54,37.32 173.54,37.14 423.54,37.14 423.54,36.96 173.54,36.96 173.54,36.78 423.54,36.78 423.54,36.6 173.54,36.6 173.54,36.42 423.54,36.42 423.54,36.24 173.54,36.24 173.54,36.06 423.54,36.06 423.54,35.88 173.54,35.88 173.54,35.7 423.54,35.7 423.54,35.52 173.54,35.52 173.54,35.34 423.54,35.34 423.54,35.16 173.54,35.16 173.54,34.98 423.54,34.98 423.54,34.8 173.54,34.8 173.54,34.62 423.54,34.62 423.54,34.44 173.54,34.44 173.54,34.26 423.54,34.26 423.54,34.08 173.54,34.08 173.54,33.9 423.54,33.9 423.54,33.72 173.54,33.72 173.54,33.54 423.54,33.54 423.54,33.36 173.54,33.36 173.54,33.18 423.54,33.18 423.54,33 173.54,33 173.54,32.82 423.54,32.82 423.54,32.64 173.54,32.64 173.54,32.46 423.54,32.46 423.54,32.28 173.54,32.28 173.54,32.1 423.54,32.1 423.54,31.92 173.54,31.92 173.54,31.74 423.54,31.74 423.54,31.56 173.54,31.56 173.54,31.38 423.54,31.38 423.54,31.2 173.54,31.2 173.54,31.02 423.54,31.02 423.54,30.84 173.54,30.84 173.54,30.66 423.54,30.66 423.54,30.48 173.54,30.48 173.54,30.3 423.54,30.3 423.54,30.12 173.54,30.12 173.54,29.94 423.54,29.94 423.54,29.76 173.54,29.76 173.54,29.58 423.54,29.58 423.54,29.4 173.54,29.4 173.54,29.22 423.54,29.22 423.54,29.04 173.54,29.04 173.54,28.86 423.54,28.86 423.54,28.68 173.54,28.68 173.54,28.5 423.54,28.5 423.54,28.32 173.54,28.32 173.54,28.14 423.54,28.14 423.54,27.96 173.54,27.96 173.54,27.78 423.54,27.78 423.54,27.6 173.54,27.6 173.54,27.42 423.54,27.42 423.54,27.24 173.54,27.24 173.54,27.06 423.54,27.06 423.54,26.88 173.54,26.88 173.54,26.7 423.54,26.7 423.54,26.52 173.54,26.52 173.54,26.34 423.54,26.34 423.54,26.16 173.54,26.16 173.54,25.98 423.54,25.98 423.54,25.8 173.54,25.8 173.54,25.62 423.54,25.62 423.54,25.44 173.54,25.44 173.54,25.26 423.54,25.26 423.54,25.08 173.54,25.08 173.54,24.9 423.54,24.9 423.54,24.72 173.54,24.72 173.54,24.54 423.54,24.54 423.54,24.36 173.54,24.36 173.54,24.18 423.54,24.18 423.54,24 173.54,24 173.54,23.82 423.54,23.82 423.54,23.64 173.54,23.64 173.54,23.46 423.54,23.46 423.54,23.28 173.54,23.28 173.54,23.1 423.54,23.1 423.54,22.92 173.54,22.92 173.54,22.74 423.54,22.74 423.54,22.56 173.54,22.56 173.54,22.38 423.54,22.38 423.54,22.2 173.54,22.2 173.54,22.02 423.54,22.02 423.54,21.84 173.54,21.84 173.54,21.66 423.54,21.66 423.54,21.48 173.54,21.48 173.54,21.3 423.54,21.3 423.54,21.12 173.54,21.12 173.54,20.94 423.54,20.94 423.54,20.76 173.54,20.76 173.54,20.58 423.54,20.58 423.54,20.4 173.54,20.4 173.54,20.22 423.54,20.22 423.54,20.04 173.54,20.04 173.54,19.86 423.54,19.86 423.54,19.68 173.54,19.68 173.54,19.5 423.54,19.5 423.54,19.32 173.54,19.32 173.54,19.14 423.54,19.14 423.54,18.96 173.54,18.96 173.54,18.78 423.54,18.78 423.54,18.6 173.54,18.6 173.54,18.42 423.54,18.42 423.54,18.24 173.54,18.24 173.54,18.06 423.54,18.06 423.54,17.88 173.54,17.88 173.54,17.7 423.54,17.7 423.54,17.52 173.54,17.52 173.54,17.34 423.54,17.34 423.54,17.16 173.54,17.16 173.54,16.98 423.54,16.98 423.54,16.8 173.54,16.8 173.54,16.62 423.54,16.62 423.54,16.44 173.54,16.44 173.54,16.26 423.54,16.26 423.54,16.08 173.54,16.08 173.54,15.9 423.54,15.9 423.54,15.72 173.54,15.72 173.54,15.54 423.54,15.54 423.54,15.36 173.54,15.36 173.54,15.18 423.54,15.18 423.54,15 173.54,15 173.54,14.82 423.54,14.82 423.54,14.64 173.54,14.64 173.54,14.46 423.54,14.46 423.54,14.28 173.54,14.28 173.54,14.1 423.54,14.1 423.54,13.92 173.54,13.92 173.54,13.74 423.54,13.74 423.54,13.56 173.54,13.56 173.54,13.38 423.54,13.38 423.54,13.2 173.54,13.2 173.54,13.02 423.54,13.02 423.54,12.84 172.82,12.84
  3V3 w0.3: 172.96,12.82 172.84,12.95 172.84,18.62 169.79,21.67 v1(169.79,22.09) 154.67,22.09 148.71,28.05 146.05,28.05 ; INNER 2.2 144.88,30.48 147.69,30.48 155.31,22.86 168.39,22.86 v1(169.79,24.25) 172.58,27.05 172.58,67.43 172.96,67.81
$2N7691: length 2.5
  Top Layer w0.6: U3.13 121.77,39.63 NOREF.44
$2N9066: length 76613.6
  Top Layer w0.1: 172.95,67.7 423.67,67.7 423.67,67.52 173.67,67.52 173.67,67.34 423.67,67.34 423.67,67.16 173.67,67.16 173.67,66.98 423.67,66.98 423.67,66.8 173.67,66.8 173.67,66.62 423.67,66.62 423.67,66.44 173.67,66.44 173.67,66.26 423.67,66.26 423.67,66.08 173.67,66.08 173.67,65.9 423.67,65.9 423.67,65.72 173.67,65.72 173.67,65.54 423.67,65.54 423.67,65.36 173.67,65.36 173.67,65.18 423.67,65.18 423.67,65 173.67,65 173.67,64.82 423.67,64.82 423.67,64.64 173.67,64.64 173.67,64.46 423.67,64.46 423.67,64.28 173.67,64.28 173.67,64.1 423.67,64.1 423.67,63.92 173.67,63.92 173.67,63.74 423.67,63.74 423.67,63.56 173.67,63.56 173.67,63.38 423.67,63.38 423.67,63.2 173.67,63.2 173.67,63.02 423.67,63.02 423.67,62.84 173.67,62.84 173.67,62.66 423.67,62.66 423.67,62.48 173.67,62.48 173.67,62.3 423.67,62.3 423.67,62.12 173.67,62.12 173.67,61.94 423.67,61.94 423.67,61.76 173.67,61.76 173.67,61.58 423.67,61.58 423.67,61.4 173.67,61.4 173.67,61.22 423.67,61.22 423.67,61.04 173.67,61.04 173.67,60.86 423.67,60.86 423.67,60.68 173.67,60.68 173.67,60.5 423.67,60.5 423.67,60.32 173.67,60.32 173.67,60.14 423.67,60.14 423.67,59.96 173.67,59.96 173.67,59.78 423.67,59.78 423.67,59.6 173.67,59.6 173.67,59.42 423.67,59.42 423.67,59.24 173.67,59.24 173.67,59.06 423.67,59.06 423.67,58.88 173.67,58.88 173.67,58.7 423.67,58.7 423.67,58.52 173.67,58.52 173.67,58.34 423.67,58.34 423.67,58.16 173.67,58.16 173.67,57.98 423.67,57.98 423.67,57.8 173.67,57.8 173.67,57.62 423.67,57.62 423.67,57.44 173.67,57.44 173.67,57.26 423.67,57.26 423.67,57.08 173.67,57.08 173.67,56.9 423.67,56.9 423.67,56.72 173.67,56.72 173.67,56.54 423.67,56.54 423.67,56.36 173.67,56.36 173.67,56.18 423.67,56.18 423.67,56 173.67,56 173.67,55.82 423.67,55.82 423.67,55.64 173.67,55.64 173.67,55.46 423.67,55.46 423.67,55.28 173.67,55.28 173.67,55.1 423.67,55.1 423.67,54.92 173.67,54.92 173.67,54.74 423.67,54.74 423.67,54.56 173.67,54.56 173.67,54.38 423.67,54.38 423.67,54.2 173.67,54.2 173.67,54.02 423.67,54.02 423.67,53.84 173.67,53.84 173.67,53.66 423.67,53.66 423.67,53.48 173.67,53.48 173.67,53.3 423.67,53.3 423.67,53.12 173.67,53.12 173.67,52.94 423.67,52.94 423.67,52.76 173.67,52.76 173.67,52.58 423.67,52.58 423.67,52.4 173.67,52.4 173.67,52.22 423.67,52.22 423.67,52.04 173.67,52.04 173.67,51.86 423.67,51.86 423.67,51.68 173.67,51.68 173.67,51.5 423.67,51.5 423.67,51.32 173.67,51.32 173.67,51.14 423.67,51.14 423.67,50.96 173.67,50.96 173.67,50.78 423.67,50.78 423.67,50.6 173.67,50.6 173.67,50.42 423.67,50.42 423.67,50.24 173.67,50.24 173.67,50.06 423.67,50.06 423.67,49.88 173.67,49.88 173.67,49.7 423.67,49.7 423.67,49.52 173.67,49.52 173.67,49.34 423.67,49.34 423.67,49.16 173.67,49.16 173.67,48.98 423.67,48.98 423.67,48.8 173.67,48.8 173.67,48.62 423.67,48.62 423.67,48.44 173.67,48.44 173.67,48.26 423.67,48.26 423.67,48.08 173.67,48.08 173.67,47.9 423.67,47.9 423.67,47.72 173.67,47.72 173.67,47.54 423.67,47.54 423.67,47.36 173.67,47.36 173.67,47.18 423.67,47.18 423.67,47 173.67,47 173.67,46.82 423.67,46.82 423.67,46.64 173.67,46.64 173.67,46.46 423.67,46.46 423.67,46.28 173.67,46.28 173.67,46.1 423.67,46.1 423.67,45.92 173.67,45.92 173.67,45.74 423.67,45.74 423.67,45.56 173.67,45.56 173.67,45.38 423.67,45.38 423.67,45.2 173.67,45.2 173.67,45.02 423.67,45.02 423.67,44.84 173.67,44.84 173.67,44.66 423.67,44.66 423.67,44.48 173.67,44.48 173.67,44.3 423.67,44.3 423.67,44.12 173.67,44.12 173.67,43.94 423.67,43.94 423.67,43.76 173.67,43.76 173.67,43.58 423.67,43.58 423.67,43.4 173.67,43.4 173.67,43.22 423.67,43.22 423.67,43.04 173.67,43.04 173.67,42.86 423.67,42.86 423.67,42.68 173.67,42.68 173.67,42.5 423.67,42.5 423.67,42.32 173.67,42.32 173.67,42.14 423.67,42.14 423.67,41.96 173.67,41.96 173.67,41.78 423.67,41.78 423.67,41.6 173.67,41.6 173.67,41.42 423.67,41.42 423.67,41.24 173.67,41.24 173.67,41.06 423.67,41.06 423.67,40.88 173.67,40.88 173.67,40.7 423.67,40.7 423.67,40.52 173.67,40.52 173.67,40.34 423.67,40.34 423.67,40.16 173.67,40.16 173.67,39.98 423.67,39.98 423.67,39.8 173.67,39.8 173.67,39.62 423.67,39.62 423.67,39.44 173.67,39.44 173.67,39.26 423.67,39.26 423.67,39.08 173.67,39.08 173.67,38.9 423.67,38.9 423.67,38.72 173.67,38.72 173.67,38.54 423.67,38.54 423.67,38.36 173.67,38.36 173.67,38.18 423.67,38.18 423.67,38 173.67,38 173.67,37.82 423.67,37.82 423.67,37.64 173.67,37.64 173.67,37.46 423.67,37.46 423.67,37.28 173.67,37.28 173.67,37.1 423.67,37.1 423.67,36.92 173.67,36.92 173.67,36.74 423.67,36.74 423.67,36.56 173.67,36.56 173.67,36.38 423.67,36.38 423.67,36.2 173.67,36.2 173.67,36.02 423.67,36.02 423.67,35.84 173.67,35.84 173.67,35.66 423.67,35.66 423.67,35.48 173.67,35.48 173.67,35.3 423.67,35.3 423.67,35.12 173.67,35.12 173.67,34.94 423.67,34.94 423.67,34.76 173.67,34.76 173.67,34.58 423.67,34.58 423.67,34.4 173.67,34.4 173.67,34.22 423.67,34.22 423.67,34.04 173.67,34.04 173.67,33.86 423.67,33.86 423.67,33.68 173.67,33.68 173.67,33.5 423.67,33.5 423.67,33.32 173.67,33.32 173.67,33.14 423.67,33.14 423.67,32.96 173.67,32.96 173.67,32.78 423.67,32.78 423.67,32.6 173.67,32.6 173.67,32.42 423.67,32.42 423.67,32.24 173.67,32.24 173.67,32.06 423.67,32.06 423.67,31.88 173.67,31.88 173.67,31.7 423.67,31.7 423.67,31.52 173.67,31.52 173.67,31.34 423.67,31.34 423.67,31.16 173.67,31.16 173.67,30.98 423.67,30.98 423.67,30.8 173.67,30.8 173.67,30.62 423.67,30.62 423.67,30.44 173.67,30.44 173.67,30.26 423.67,30.26 423.67,30.08 173.67,30.08 173.67,29.9 423.67,29.9 423.67,29.72 173.67,29.72 173.67,29.54 423.67,29.54 423.67,29.36 173.67,29.36 173.67,29.18 423.67,29.18 423.67,29 173.67,29 173.67,28.82 423.67,28.82 423.67,28.64 173.67,28.64 173.67,28.46 423.67,28.46 423.67,28.28 173.67,28.28 173.67,28.1 423.67,28.1 423.67,27.92 173.67,27.92 173.67,27.74 423.67,27.74 423.67,27.56 173.67,27.56 173.67,27.38 423.67,27.38 423.67,27.2 173.67,27.2 173.67,27.02 423.67,27.02 423.67,26.84 173.67,26.84 173.67,26.66 423.67,26.66 423.67,26.48 173.67,26.48 173.67,26.3 423.67,26.3 423.67,26.12 173.67,26.12 173.67,25.94 423.67,25.94 423.67,25.76 173.67,25.76 173.67,25.58 423.67,25.58 423.67,25.4 173.67,25.4 173.67,25.22 423.67,25.22 423.67,25.04 173.67,25.04 173.67,24.86 423.67,24.86 423.67,24.68 173.67,24.68 173.67,24.5 423.67,24.5 423.67,24.32 173.67,24.32 173.67,24.14 423.67,24.14 423.67,23.96 173.67,23.96 173.67,23.78 423.67,23.78 423.67,23.6 173.67,23.6 173.67,23.42 423.67,23.42 423.67,23.24 173.67,23.24 173.67,23.06 423.67,23.06 423.67,22.88 173.67,22.88 173.67,22.7 423.67,22.7 423.67,22.52 173.67,22.52 173.67,22.34 423.67,22.34 423.67,22.16 173.67,22.16 173.67,21.98 423.67,21.98 423.67,21.8 173.67,21.8 173.67,21.62 423.67,21.62 423.67,21.44 173.67,21.44 173.67,21.26 423.67,21.26 423.67,21.08 173.67,21.08 173.67,20.9 423.67,20.9 423.67,20.72 173.67,20.72 173.67,20.54 423.67,20.54 423.67,20.36 173.67,20.36 173.67,20.18 423.67,20.18 423.67,20 173.67,20 173.67,19.82 423.67,19.82 423.67,19.64 173.67,19.64 173.67,19.46 423.67,19.46 423.67,19.28 173.67,19.28 173.67,19.1 423.67,19.1 423.67,18.92 173.67,18.92 173.67,18.74 423.67,18.74 423.67,18.56 173.67,18.56 173.67,18.38 423.67,18.38 423.67,18.2 173.67,18.2 173.67,18.02 423.67,18.02 423.67,17.84 173.67,17.84 173.67,17.66 423.67,17.66 423.67,17.48 173.67,17.48 173.67,17.3 423.67,17.3 423.67,17.12 173.67,17.12 173.67,16.94 423.67,16.94 423.67,16.76 173.67,16.76 173.67,16.58 423.67,16.58 423.67,16.4 173.67,16.4 173.67,16.22 423.67,16.22 423.67,16.04 173.67,16.04 173.67,15.86 423.67,15.86 423.67,15.68 173.67,15.68 173.67,15.5 423.67,15.5 423.67,15.32 173.67,15.32 173.67,15.14 423.67,15.14 423.67,14.96 173.67,14.96 173.67,14.78 423.67,14.78 423.67,14.6 173.67,14.6 173.67,14.42 423.67,14.42 423.67,14.24 173.67,14.24 173.67,14.06 423.67,14.06 423.67,13.88 173.67,13.88 173.67,13.7 423.67,13.7 423.67,13.52 173.67,13.52 173.67,13.34 423.67,13.34 423.67,13.16 173.67,13.16 173.67,12.98 423.67,12.98 423.67,12.8 172.95,12.8
  Top Layer w0.3: 173.09,67.69 172.96,67.69 172.45,67.18 172.45,57.99 168.13,53.67 168.13,53.29 ; STRAIN 1.2 170.69,51.55 172.58,49.65 172.58,12.95 172.71,12.82 172.96,12.82
$3N1098: length 3.9
  Top Layer w0.4: Q5.3 50.75,55.49 R9.1
$3N1099: length 3.8
  Top Layer w0.4: Q6.3 54.48,51.74
$3N1100: length 4.1
  Top Layer w0.4: Q6.1 52.69,50.79 R8.2
$3N1101: length 4.1
  Top Layer w0.4: 52.7,54.49 52.68,54.48 R7.2
$3N1118: length 4.4
  Top Layer w0.3: C9.2 31.83,51.27 32.5,51.94 33.8,51.94 U5.6

## Copper pours and planes (outline as drawn; the poured copper is in the pictures)
3V3 on 3V3: 4.88,59.7 4.9,59.88 4.96,60.07 5.05,60.25 5.18,60.41 5.33,60.54 5.51,60.63 5.71,60.69 5.88,60.7 125.23,60.7 125.4,60.69 125.6,60.63 125.78,60.54 125.93,60.41 126.06,60.25 126.16,60.07 126.21,59.88 126.23,59.7 126.23,20.81 126.21,20.63 126.16,20.44 126.06,20.26 125.93,20.1 125.78,19.97 125.6,19.88 125.4,19.82 125.23,19.81 5.88,19.81 5.71,19.82 5.51,19.88 5.33,19.97 5.18,20.1 5.05,20.26 4.96,20.44 4.9,20.63 4.88,20.81
GND on GND: 3.04,59.57 3.05,59.75 3.11,59.94 3.2,60.12 3.33,60.28 3.49,60.41 3.67,60.5 3.86,60.56 4.04,60.57 166.5,60.57 166.68,60.56 166.87,60.5 167.05,60.41 167.21,60.28 167.34,60.12 167.43,59.94 167.49,59.75 167.5,59.57 167.5,20.81 167.49,20.63 167.43,20.44 167.34,20.26 167.21,20.1 167.05,19.97 166.87,19.88 166.68,19.82 166.5,19.81 4.04,19.81 3.86,19.82 3.67,19.88 3.49,19.97 3.33,20.1 3.2,20.26 3.11,20.44 3.05,20.63 3.04,20.81

## Text on the board
Bottom Layer: - | +
Bottom Silkscreen Layer: WARNING: / Paddle may cause spanking
Top Silkscreen Layer: GND | 3v3 | IO33 | IO32 | IO35 | IO34 | RESET | OFF | ON | - | + | A2 | AVDD (+3v) | A1 | SD0 | SC | Reading | Strain 2 | Strain 1 | Inner 2 | Inner 1 | ohm | AVDD | ExcitationVoltage   ~ 3.1v | Reading Voltage    +/- 0.04v | Excitation | = | (R1 + R3) x (R2 + R4) | (R2 x R3) - (R1 x R4) | Strain 2 (R1) | Inner 1 (R4) | Inner 2 (R3) | Strain 1 (R2) | Voltage | 2024 OSHWA Summit - https://www.oshwa.org/ | Sensors in the bedroom workshop @ | KinkyMakers.com | Can never have enough lights | USB to 3v3 | 5-24v (9v recommended) | <-- USB to Serial | ESP reset / on upload | Battery to 3.3v | 3.3v is Good | coloured lights | are fun !! | ESP32 Processor + WiFi | Accelerometer | <--- X+ | Amplifier for Wheatstone Bridge | Wheatstone Bridge | Accelerometer / Model:          LIS2DW12TR / SCL:             IO25 / SDA:             IO26 / Interrupt 1:   IO27 / Interrupt 2:   IO17 | Light Emitting Diodes / WS2812b:        IO12 / Red:                IO14 / Green:             IO16 | Amplifier for Wheatstone Bridge / Model:            HX711 / Digital Out:     IO19 / Clock:             IO18 | <--- Y+ | (Z)
